# Altium project Pi_project.PrjPcb
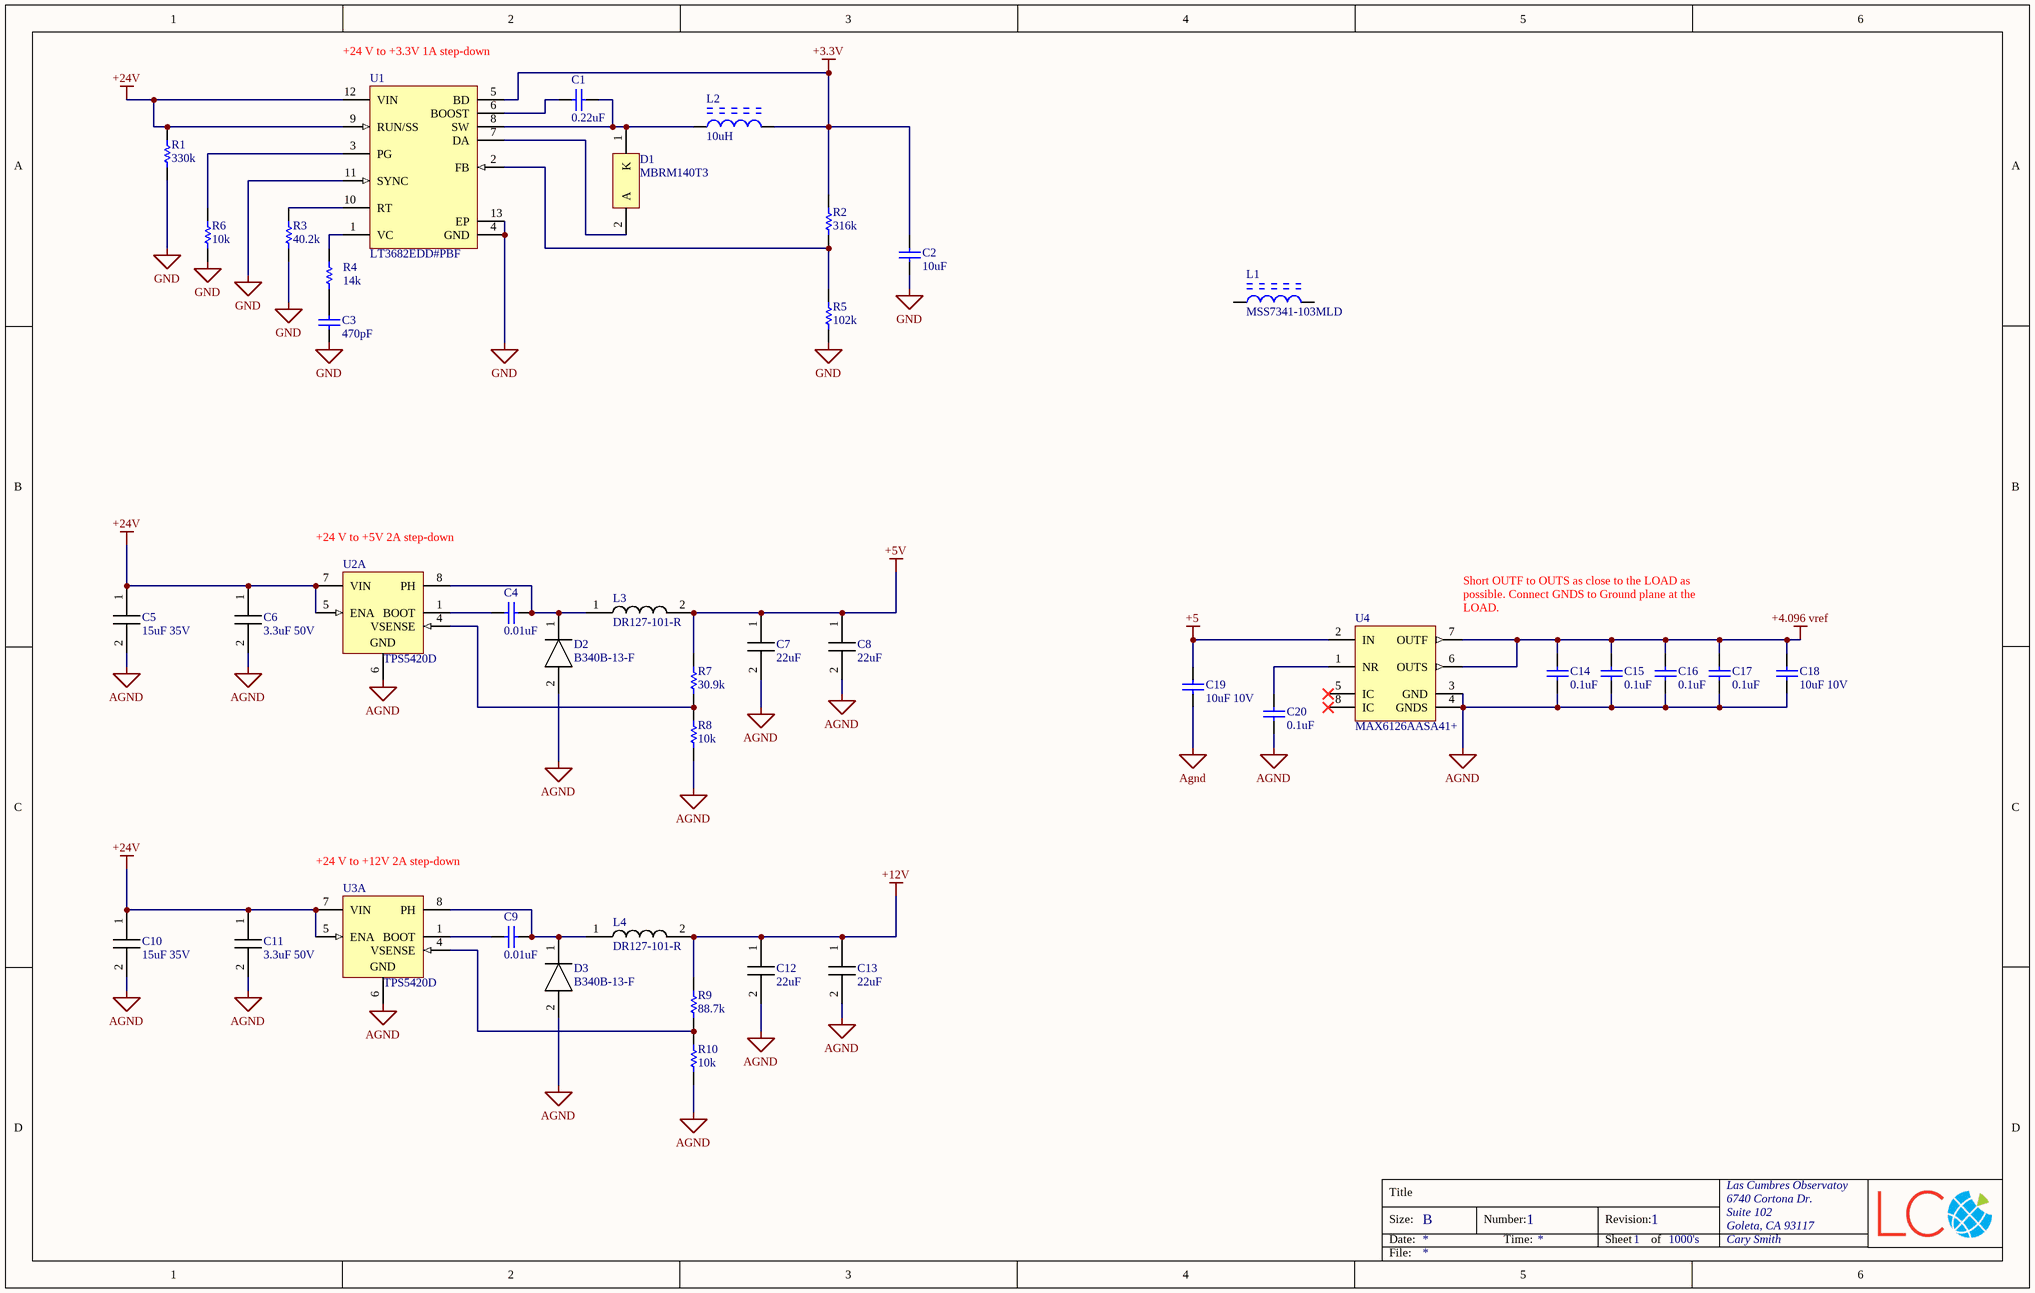
[diagram p0: Pi_Power.SchDoc]
9 sheets, 129 parts. Net scope: global (net labels, ports and power ports of the same name join across sheets).
Sheets:
  Pi_Power.SchDoc
  Pi_FPGA.SchDoc
  Pi_USB_2_UART.SchDoc
  Pi_HDMI.SchDoc
  Pi_ADC.SchDoc
  Pi_SD_CARD.SchDoc
  Pi_DISP.SchDoc
  Pi_Ethernet_USB.SchDoc
  Pi_BISS_422_485.SchDoc

## Sheet Pi_Power.SchDoc: =DocumentName
size B; DrawnBy: Cary Smith; Organization: Las Cumbres Observatoy; Address1: 6740 Cortona Dr.; Address2: Suite 102; Address3: Goleta, CA 93117; DocumentNumber: 1; Revision: 1; SheetNumber: 1; SheetTotal: 1000's

### Parts
C1  0.22uF  [CAPC1608X90X35NL15T15]
C2  10uF  [CAPC2013X145X50NL20T25]
C3  470pF  [CAPC1005X55X25ML05T10]
C4  0.01uF  [CAPC1608X90X35LL15T15]
C5  15uF 35V  [CAPPM7343X310N]
C6  3.3uF 50V  [CAPC3225X230N]
C7  22uF  [CAPC3216X180N]
C8  22uF  [CAPC3216X180N]
C9  0.01uF  [CAPC1608X90X35LL15T15]
C10  15uF 35V  [CAPPM7343X310N]
C11  3.3uF 50V  [CAPC3225X230N]
C12  22uF  [CAPC3216X180N]
C13  22uF  [CAPC3216X180N]
C14  0.1uF  [CAPC1005X55X25ML05T10]
C15  0.1uF  [CAPC1005X55X25ML05T10]
C16  0.1uF  [CAPC1005X55X25ML05T10]
C17  0.1uF  [CAPC1005X55X25ML05T10]
C18  10uF 10V  [CAPC1609X100X15LL20]
C19  10uF 10V  [CAPC1609X100X15LL20]
C20  0.1uF  [CAPC1005X55X25ML05T10]
D1  MBRM140T3  [ONSC-POWERMITE-2-457-04_D_V]
D2  B340B-13-F  [DIOM5336X250N]
D3  B340B-13-F  [DIOM5336X250N]
L1  MSS7341-103MLD  [COIL-MSS7341_V]
L2  10uH  [COIL-MSS7341_V]
L3  DR127-101-R  [INDM125125X800N]
L4  DR127-101-R  [INDM125125X800N]
R1  330k  [RESC1005X40X25ML05T05]
R2  316k  [RESC1005X40X25LL05T05]
R3  40.2k  [RESC1005X40X25NL05T05]
R4  14k  [RESC1005X40X25LL05T05]
R5  102k  [RESC1005X40X25ML05T05]
R6  10k  [RESC1005X40X25NL05T05]
R7  30.9k  [RESC1005X40X25NL05T05]
R8  10k  [RESC1005X40X25NL05T05]
R9  88.7k  [RESC1005X40X25NL05T05]
R10  10k  [RESC1005X40X25NL05T05]
U1  LT3682EDD#PBF  [LT-DD-12_V]
U2  TPS5420D  [D0008A_L]  (part A of 2)
U3  TPS5420D  [D0008A_L]  (part A of 2)
U4  MAX6126AASA41+  [MAXM-S8+4_M]

### Nets
+3.3V: C2.2 L2.2 R2.2 U1.5(BD)
+4.096 vref: C14.2 C15.2 C16.2 C17.2 C18.2 U4.6(OUTS) U4.7(OUTF)
+5: C19.2 U4.2(IN)
+5V: C7.1 C8.1 L3.2 R7.2
+12V: C12.1 C13.1 L4.2 R9.2
+24V: C5.1(+) C6.1 C10.1(+) C11.1 R1.2 U1.9(RUN/SS) U1.12(VIN) U2.5(ENA) U2.7(VIN) U3.5(ENA) U3.7(VIN)
AGND: C5.2(-) C6.2 C7.2 C8.2 C10.2(-) C11.2 C12.2 C13.2 C14.1 C15.1 C16.1 C17.1 C18.1 C19.1 C20.1 D2.2(A) D3.2(A) R8.1 R10.1 U2.6(GND) U3.6(GND) U4.3(GND) U4.4(GNDS)
GND: C2.1 C3.1 R1.1 R3.1 R5.1 R6.1 U1.4(GND) U1.11(SYNC) U1.13(EP)
NetC1_1: C1.1 D1.1(K) L2.1 U1.8(SW)
NetC1_2: C1.2 U1.6(BOOST)
NetC3_2: C3.2 R4.1
NetC4_1: C4.1 U2.1(BOOT)
NetC4_2: C4.2 D2.1(K) L3.1 U2.8(PH)
NetC9_1: C9.1 U3.1(BOOT)
NetC9_2: C9.2 D3.1(K) L4.1 U3.8(PH)
NetC20_2: C20.2 U4.1(NR)
NetD1_2: D1.2(A) U1.7(DA)
NetR2_1: R2.1 R5.2 U1.2(FB)
NetR3_2: R3.2 U1.10(RT)
NetR4_2: R4.2 U1.1(VC)
NetR6_2: R6.2 U1.3(PG)
NetR7_1: R7.1 R8.2 U2.4(VSENSE)
NetR9_1: R9.1 R10.2 U3.4(VSENSE)

Not connected (* = marked no-connect by the designer): L1 1 2; U4 5(IC)* 8(IC)*

### Notes on the sheet
- (near U1) +24 V to +3.3V 1A step-down
- (near U2) +24 V to +5V 2A step-down
- Short OUTF to OUTS as close to the LOAD as possible. Connect GNDS to Ground plane at the LOAD.
- (near U3) +24 V to +12V 2A step-down
- Title
- Size:
- Date:
- B
- Number:
- Time:
- Revision:
- Sheet
- of
- File:

### Library data of the parts
C1 = CMP-2006-04195-1: 06033D224KAT2A; Manufacturer: AVX Interconnect / Elco; Part Number: 06033D224KAT2A
C2 = CMP-2007-01019-1: C0805C106M8PACTU; Manufacturer: Kemet; Part Number: C0805C106M8PACTU
C3 = CMP-2008-04369-1: GRM1555C1H471JA01D; Manufacturer: Murata; Part Number: GRM1555C1H471JA01D
C4 C9 = CMP-2006-04374-1: 06035C-103KAT2A; Manufacturer: AVX Interconnect / Elco; Part Number: 06035C-103KAT2A
C5 C10 = 293D156X9035D2TE3: Capacitor 293D156X9035D2TE3; Manufacturer_Name: Vishay; Allied_Number: 70398878; Datasheet Link: http://www.vishay.com/docs/40002/293d.pdf; Height: 3.1mm; Manufacturer_Part_Number: 293D156X9035D2TE3; Mouser Part Number: 74-293D156X9035D2TE3; Mouser Price/Stock: https://www.mouser.com/Search/Refine.aspx?Keyword=74-293D156X9035D2TE3; RS Part Number: 6843960; RS Price/Stock: http://uk.rs-online.com/web/p/tantalum-capacitors/6843960/?source=DS; Allied Price/Stock: https://www.alliedelec.com/vishay-dale-293d156x9035d2te3/70398878/
C6 C11 = C3225X7R1H335M250AB: Capacitor C3225X7R1H335M250AB; Manufacturer_Name: TDK; Datasheet Link: https://product.tdk.com/info/en/catalog/datasheets/mlcc_commercial_midvoltage_en.pdf; Height: 2.3mm; Manufacturer_Part_Number: C3225X7R1H335M250AB; RS Part Number: 9163037P; RS Price/Stock: http://uk.rs-online.com/web/p/products/9163037P
C7 C8 C12 C13 = C3216X6S1C226M160AC: Capacitor C3216X6S1C226M160AC; Manufacturer_Name: TDK; Datasheet Link: https://product.tdk.com/info/en/catalog/datasheets/mlcc_commercial_midvoltage_en.pdf; Height: 1.8mm; Manufacturer_Part_Number: C3216X6S1C226M160AC
C14-C17 C20 = CMP-2008-02013-1: VJ0402G104KXQCW1BC; Manufacturer: Vitramon; Part Number: VJ0402G104KXQCW1BC
C18 C19 = CMP-2006-00193-1: TACL106M010XTA; Manufacturer: AVX Interconnect / Elco; Part Number: TACL106M010XTA
D1 = CMP-1055-00287-1: Schottky Power Rectifier, 2-Pin Powermite, Tape and Reel; Manufacturer: On Semiconductor; Configuration: Single; IFSM Max (A): 50; ComponentLink3Description: Package Specification; Packing: Tape and Reel; RoHS: FALSE; ComponentLink1Description: Manufacturer URL; ComponentLink2URL: http://www.onsemi.cn/pub/Collateral/MBRM140-D.PDF; DatasheetVersion: Rev. 4; PartNumber: MBRM140T3; ComponentLink1URL: http://www.onsemi.com/; ComponentLink3URL: http://www.onsemi.com/pub_link/Collateral/457-04.PDF; PackageVersion: Rev. F, 05/2013; PackageDescription: 2-Pin POWERMITE, Body 1.965 x 1.9 mm; Mounting Technology: Surface Mount; ComponentLink2Description: Datasheet; PackageReference: POWERMITE-2-457-04
D2 D3 = B340B-13-F: Diode; Manufacturer_Name: Diodes Inc.; Datasheet Link: https://componentsearchengine.com/Datasheets/2/B340B-13-F.pdf; Height: 2.5mm; Manufacturer_Part_Number: B340B-13-F; Mouser Part Number: 621-B340B-F; Mouser Price/Stock: https://www.mouser.com/Search/Refine.aspx?Keyword=621-B340B-F; RS Part Number: 9228119; RS Price/Stock: http://uk.rs-online.com/web/p/products/9228119
L1 = CMP-2000-06766-1: Shielded Power Inductor, 10 uH, +/- 20%, 3.8 A, 2-Pin SMD, RoHS, Tape and Reel; Manufacturer: Coilcraft; Maximum DC Current: 3.8A; Test Frequency: 100kHz; Self Resonant Frequency: 32MHz; Maximum DC Resistance: 38mOhms; Core Material: Ferrite; Inductance: 10uH; Manufacturer URL: http://www.coilcraft.com/; Length: 7.3mm; Series: MSS7341; Product Category: FixedInductors; Product: PowerInductors; Datasheet URL: http://www.coilcraft.com/pdfs/MSS7341.pdf; Termination Style: SMD/SMT; Tolerance: 20%; RoHS: True; Width: 7.3mm; Package Reference: MSS7341; Datasheet Version: 12/2015; Operating Temperature Range: -40Cto+85C; Height: 4.1mm; Mounting Style: SMD/SMT; Mounting Technology: SurfaceMount; Shielding: Shielded; Brand: Coilcraft; Package Description: 2-Pin Surface Mounted Device , Body 6.6 x 6.6 mm; Packaging: Reel
L2 = CMP-2000-06766-1: Shielded Power Inductor, 10 uH, +/- 20%, 3.8 A, 2-Pin SMD, RoHS, Tape and Reel MSS7341-103MLD; Manufacturer: Coilcraft; Maximum DC Current: 3.8A; Test Frequency: 100kHz; Self Resonant Frequency: 32MHz; Maximum DC Resistance: 38mOhms; Core Material: Ferrite; Manufacturer URL: http://www.coilcraft.com/; Length: 7.3mm; Series: MSS7341; Product Category: FixedInductors; Product: PowerInductors; Datasheet URL: http://www.coilcraft.com/pdfs/MSS7341.pdf; Termination Style: SMD/SMT; Tolerance: 20%; RoHS: True; Width: 7.3mm; Package Reference: MSS7341; Datasheet Version: 12/2015; Operating Temperature Range: -40Cto+85C; Height: 4.1mm; Mounting Style: SMD/SMT; Mounting Technology: SurfaceMount; Shielding: Shielded; Brand: Coilcraft; Package Description: 2-Pin Surface Mounted Device , Body 6.6 x 6.6 mm; Packaging: Reel; Inductance: 10uH
L3 L4 = DR127-101-R: Inductor; Manufacturer_Name: COILTRONICS; Allied_Number: 70037928; Manufacturer_Part_Number: DR127-101-R; Mouser Part Number: 704-DR127-101-R; Mouser Price/Stock: http://www.mouser.com/Search/ProductDetail.aspx?qs=yzwxPInThYS5S9GNGzgpHA%3d%3d; RS Part Number: 704-DR127-101-R; RS Price/Stock: http://www.mouser.com/Search/ProductDetail.aspx?qs=yzwxPInThYS5S9GNGzgpHA%3d%3d; Allied Price/Stock: https://www.alliedelec.com/coiltronics-dr127-101-r/70037928/
R1 = CMP-2002-08524-1: CRCW0402330RJNED; Manufacturer: Vishay Dale; Part Number: CRCW0402330RJNED
R2 = CMP-2002-08513-1: CRCW0402316KFKED; Manufacturer: Vishay Dale; Part Number: CRCW0402316KFKED
R3 = CMP-2002-08617-1: CRCW040240K2FKED; Manufacturer: Vishay Dale; Part Number: CRCW040240K2FKED
R4 = CMP-2002-08207-1: CRCW040214K0FKED; Manufacturer: Vishay Dale; Part Number: CRCW040214K0FKED
R5 = CMP-2002-08130-1: CRCW0402102KFKED; Manufacturer: Vishay Dale; Part Number: CRCW0402102KFKED
R6 R8 R10 = CMP-2002-08135-1: CRCW040210K0FKED; Manufacturer: Vishay Dale; Part Number: CRCW040210K0FKED
R7 = CMP-2002-00859-1: ERJ-2RKF30R9X; Manufacturer: Panasonic; Part Number: ERJ-2RKF30R9X
R9 = CMP-2002-00251-1: CRCW040288K7FKED; Manufacturer: Vishay Dale; Part Number: CRCW040288K7FKED
U1 = CMP-0491-00244-1: 1 A Micropower Step-Down Switching Regulator, 12-pin SON (DD-12), -40 to 125 degC, Pb-Free; Manufacturer: Linear Technology; Number of Outputs: 1; Over Voltage Protection(V): 60; Frequency Adjust Range: 250kHz - 2.2MHz; RoHS: TRUE; PackageDescription: 12-Pin Plastic DFN, Body 3 x 3 mm, Pitch 0.45 mm; PackageReference: DD-12; PartNumber: LT3682EDD#PBF; ComponentLink1URL: http://www.linear.com/; ComponentLink3URL: http://cds.linear.com/docs/en/packaging/DFN_12_05-08-1725.pdf; Mounting Technology: Surface Mount; ComponentLink1Description: Manufacturer URL; ComponentLink3Description: Package Specification; PackageVersion: Rev. A, 06/2010; ComponentLink2Description: Datasheet; ComponentLink2URL: http://cds.linear.com/docs/en/datasheet/3682f.pdf
U2 U3 = CMP-0323-00173-3: Buck Step Down Regulator with 5.5 to 36 V Input and 1.23 to 31 V Output, -40 to 125 degC, 8-Pin SOIC (D), Green (RoHS & no Sb/Br); Manufacturer: Texas Instruments; Vin(Max)(V): 36; Duty Cycle(Max)(%): 87; Vout(Max)(V): 31; Vout(Min)(V): 1.23; Switch Current Limit(Typ)(A): 3; Vin(Min)(V): 5.5; Regulated Outputs(#): 1; Rating: Catalog; Iout(Max)(A): 2; SubFamily: Step-Down Regulator; Code_JEDEC: MS-012AA; Topology: Buck; PackageDescription: 8-Pin Plastic Small Outline Integrated Circuit, 4.9 x 3.9 mm, Pitch 1.27 mm Pitch; PackageVersion: revM, Jun-2011; ComponentLink2Description: Package Specification; ComponentLink1URL: http://www.ti.com/general/docs/lit/getliterature.tsp?genericPartNumber=TPS5420&fileType=pdf; Mounting Technology: Surface Mount; ComponentLink3Description: URL Link1; PackageReference: D0008A; ComponentLink1Description: Datasheet; ComponentLink3URL: Samples URL:http://www.ti.com/product/tps5420#samples; Eco-Plan: Green (RoHS & no Sb/Br); ComponentLink2URL: http://www.ti.com/litv/pdf/msoi002j; DatasheetVersion: SLVS642C; Iq(Typ)(mA): 3; PartNumber: TPS5420D
U4 = CMP-0977-00016-1: Ultra-High-Precision, Ultra-Low-Noise, Series Voltage Reference, 4.096 V, -40 to 125 degC, 8-Pin SOIC (S8+4), RoHS, Tube; Manufacturer: Maxim; Output Voltage Accuracy: 0.02% Max.; Line Regulation: 60 uV/V Max.; VOUT: 4.096 V; Dropout Voltage@10 mA: 0.1 V Typ.; VIN: 4.3 to 12.6 V; Operating Temperature: -40 to 125 degC; ComponentLink3URL: http://pdfserv.maximintegrated.com/package_dwgs/21-0041.PDF; PartNumber: MAX6126AASA41+; RoHS: TRUE; ComponentLink3Description: Package Specification; ComponentLink1URL: http://www.maximintegrated.com/; Mounting Technology: Surface Mount; Packing: Tube; DatasheetVersion: Rev. 6; ComponentLink1Description: Manufacturer URL; ComponentLink2URL: http://datasheets.maximintegrated.com/en/ds/MAX6126.pdf; PackageDescription: 8-Pin Small Outline Integrated Circuit Package, Body 4.9 x 3.9 mm, Pitch 1.27 mm; ComponentLink2Description: Datasheet; PackageVersion: Rev. E

## Sheet Pi_FPGA.SchDoc: =DocumentName
size B; DrawnBy: Cary Smith; Organization: Las Cumbres Observatoy; Address1: 6740 Cortona Dr.; Address2: Suite 102; Address3: Goleta, CA 93117; DocumentNumber: 1; Revision: 1; SheetNumber: 1; SheetTotal: 1000's
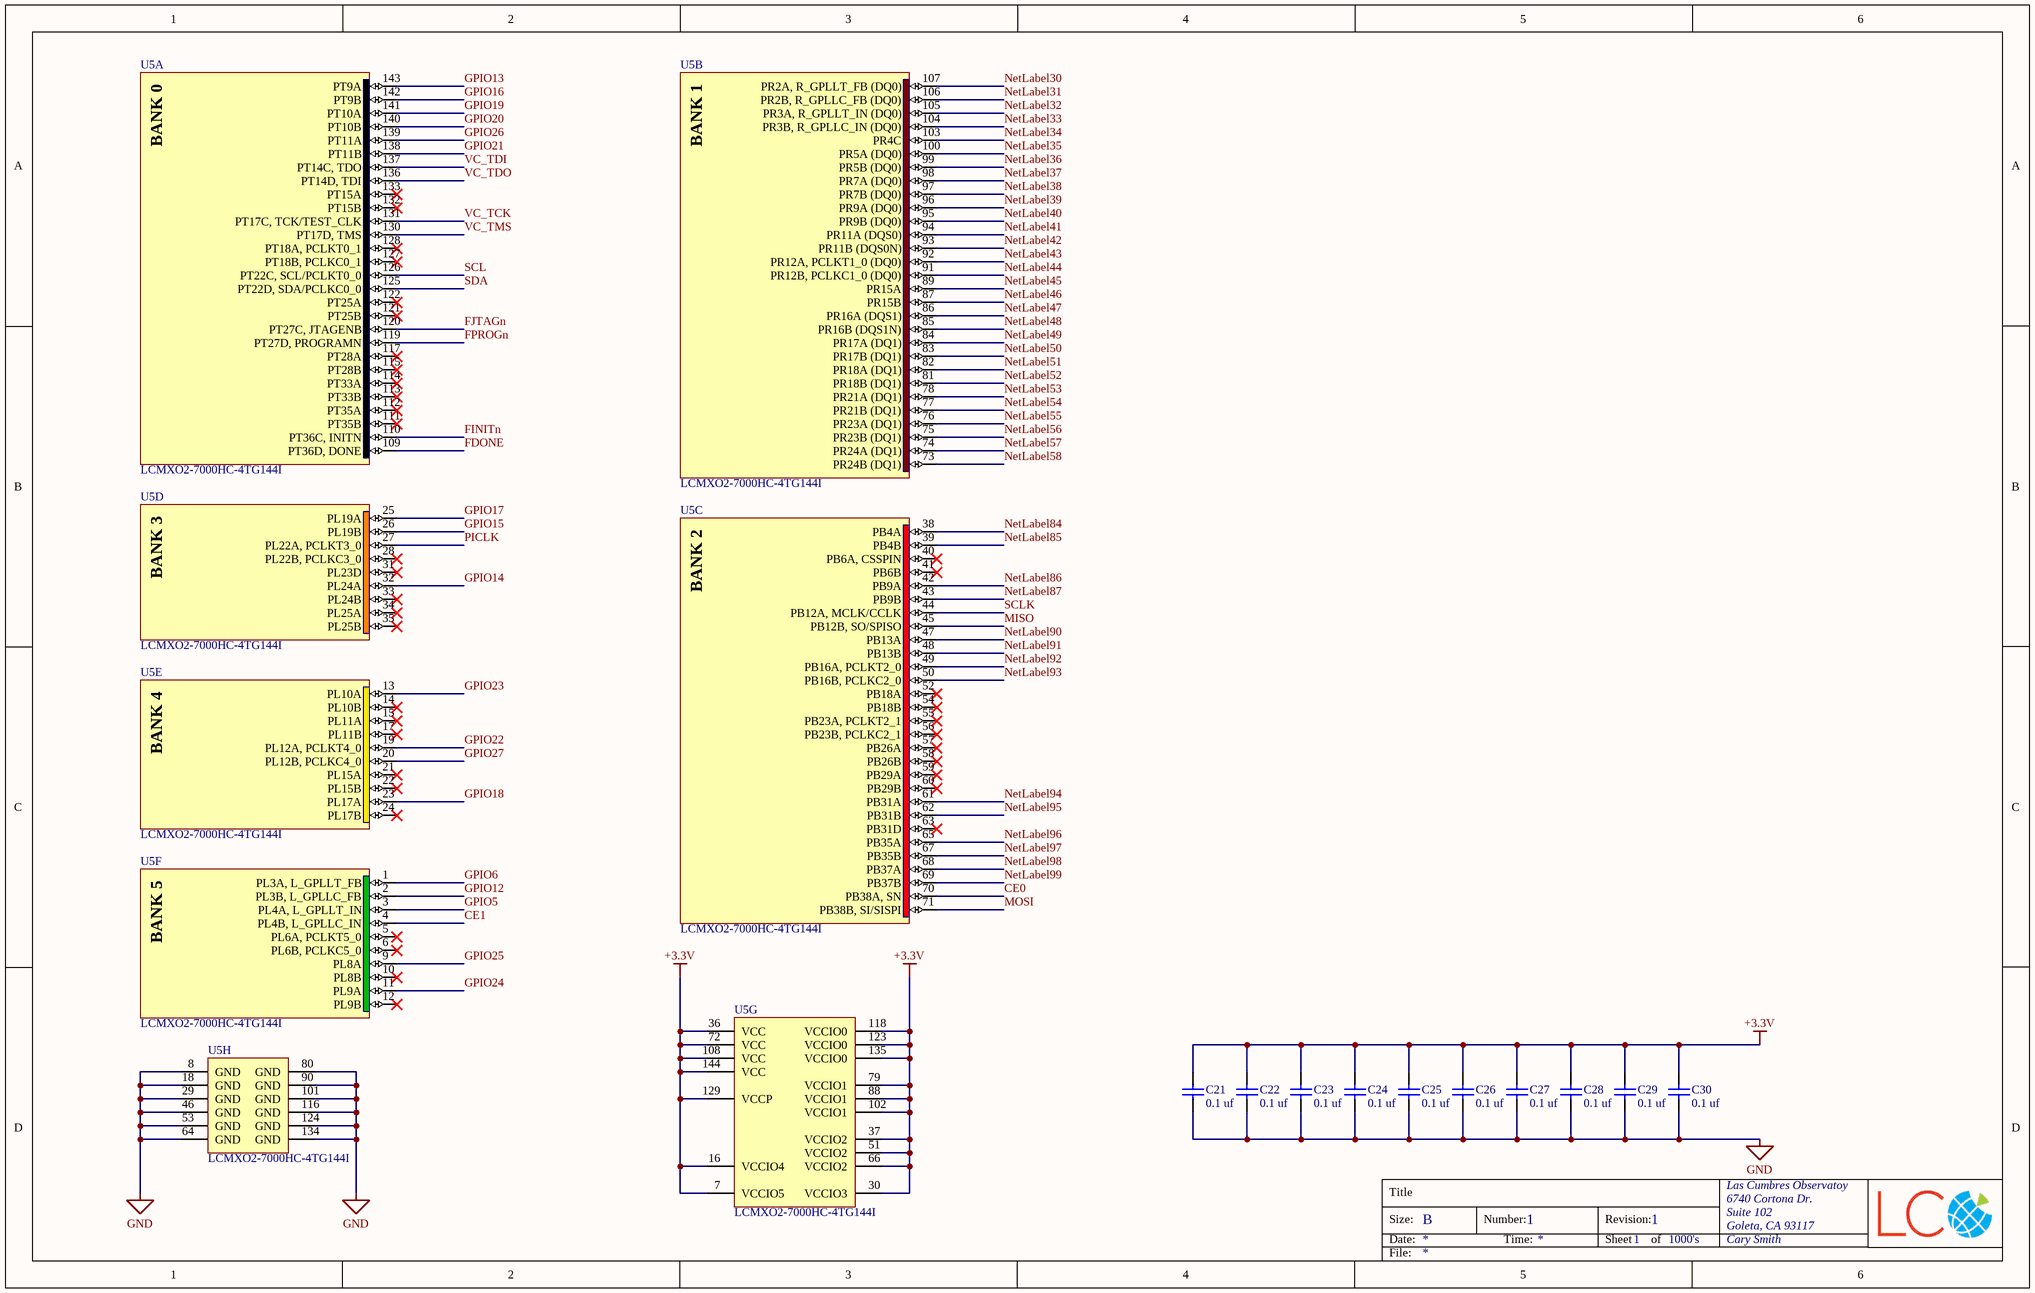
[diagram p1: Pi_FPGA.SchDoc]

### Parts
C21  0.1 uf  [CAPC1608X92X38LL15T08]
C22  0.1 uf  [CAPC1608X92X38LL15T08]
C23  0.1 uf  [CAPC1608X92X38LL15T08]
C24  0.1 uf  [CAPC1608X92X38LL15T08]
C25  0.1 uf  [CAPC1608X92X38LL15T08]
C26  0.1 uf  [CAPC1608X92X38LL15T08]
C27  0.1 uf  [CAPC1608X92X38LL15T08]
C28  0.1 uf  [CAPC1608X92X38LL15T08]
C29  0.1 uf  [CAPC1608X92X38LL15T08]
C30  0.1 uf  [CAPC1608X92X38LL15T08]
U5  LCMXO2-7000HC-4TG144I  [TQFP144_N]  (parts A,B,C,D,E,F,G,H of 8)

### Nets
+3.3V: C21.2 C22.2 C23.2 C24.2 C25.2 C26.2 C27.2 C28.2 C29.2 C30.2 U5.7(VCCIO5) U5.16(VCCIO4) U5.30(VCCIO3) U5.36(VCC) U5.37(VCCIO2) U5.51(VCCIO2) U5.66(VCCIO2) U5.72(VCC) U5.79(VCCIO1) U5.88(VCCIO1) U5.102(VCCIO1) U5.108(VCC) U5.118(VCCIO0) U5.123(VCCIO0) U5.129(VCCP) U5.135(VCCIO0) U5.144(VCC)
GND: C21.1 C22.1 C23.1 C24.1 C25.1 C26.1 C27.1 C28.1 C29.1 C30.1 U5.8(GND) U5.18(GND) U5.29(GND) U5.46(GND) U5.53(GND) U5.64(GND) U5.80(GND) U5.90(GND) U5.101(GND) U5.116(GND) U5.124(GND) U5.134(GND)
CE0: U5.70(PB38A,_SN)
CE1: U5.4(PL4B,_L_GPLLC_IN)
FDONE: U5.109(PT36D,_DONE)
FINITn: U5.110(PT36C,_INITN)
FJTAGn: U5.120(PT27C,_JTAGENB)
FPROGn: U5.119(PT27D,_PROGRAMN)
GPIO5: U5.3(PL4A,_L_GPLLT_IN)
GPIO6: U5.1(PL3A,_L_GPLLT_FB)
GPIO12: U5.2(PL3B,_L_GPLLC_FB)
GPIO13: U5.143(PT9A)
GPIO14: U5.32(PL24A)
GPIO15: U5.26(PL19B)
GPIO16: U5.142(PT9B)
GPIO17: U5.25(PL19A)
GPIO18: U5.23(PL17A)
GPIO19: U5.141(PT10A)
GPIO20: U5.140(PT10B)
GPIO21: U5.138(PT11B)
GPIO22: U5.19(PL12A,_PCLKT4_0)
GPIO23: U5.13(PL10A)
GPIO24: U5.11(PL9A)
GPIO25: U5.9(PL8A)
GPIO26: U5.139(PT11A)
GPIO27: U5.20(PL12B,_PCLKC4_0)
MISO: U5.45(PB12B,_SO/SPISO)
MOSI: U5.71(PB38B,_SI/SISPI)
NetLabel30: U5.107(PR2A,_R_GPLLT_FB_(DQ0))
NetLabel31: U5.106(PR2B,_R_GPLLC_FB_(DQ0))
NetLabel32: U5.105(PR3A,_R_GPLLT_IN_(DQ0))
NetLabel33: U5.104(PR3B,_R_GPLLC_IN_(DQ0))
NetLabel34: U5.103(PR4C)
NetLabel35: U5.100(PR5A_(DQ0))
NetLabel36: U5.99(PR5B_(DQ0))
NetLabel37: U5.98(PR7A_(DQ0))
NetLabel38: U5.97(PR7B_(DQ0))
NetLabel39: U5.96(PR9A_(DQ0))
NetLabel40: U5.95(PR9B_(DQ0))
NetLabel41: U5.94(PR11A_(DQS0))
NetLabel42: U5.93(PR11B_(DQS0N))
NetLabel43: U5.92(PR12A,_PCLKT1_0_(DQ0))
NetLabel44: U5.91(PR12B,_PCLKC1_0_(DQ0))
NetLabel45: U5.89(PR15A)
NetLabel46: U5.87(PR15B)
NetLabel47: U5.86(PR16A_(DQS1))
NetLabel48: U5.85(PR16B_(DQS1N))
NetLabel49: U5.84(PR17A_(DQ1))
NetLabel50: U5.83(PR17B_(DQ1))
NetLabel51: U5.82(PR18A_(DQ1))
NetLabel52: U5.81(PR18B_(DQ1))
NetLabel53: U5.78(PR21A_(DQ1))
NetLabel54: U5.77(PR21B_(DQ1))
NetLabel55: U5.76(PR23A_(DQ1))
NetLabel56: U5.75(PR23B_(DQ1))
NetLabel57: U5.74(PR24A_(DQ1))
NetLabel58: U5.73(PR24B_(DQ1))
NetLabel84: U5.38(PB4A)
NetLabel85: U5.39(PB4B)
NetLabel86: U5.42(PB9A)
NetLabel87: U5.43(PB9B)
NetLabel90: U5.47(PB13A)
NetLabel91: U5.48(PB13B)
NetLabel92: U5.49(PB16A,_PCLKT2_0)
NetLabel93: U5.50(PB16B,_PCLKC2_0)
NetLabel94: U5.61(PB31A)
NetLabel95: U5.62(PB31B)
NetLabel96: U5.65(PB35A)
NetLabel97: U5.67(PB35B)
NetLabel98: U5.68(PB37A)
NetLabel99: U5.69(PB37B)
PICLK: U5.27(PL22A,_PCLKT3_0)
SCL: U5.126(PT22C,_SCL/PCLKT0_0)
SCLK: U5.44(PB12A,_MCLK/CCLK)
SDA: U5.125(PT22D,_SDA/PCLKC0_0)
VC_TCK: U5.131(PT17C,_TCK/TEST_CLK)
VC_TDI: U5.137(PT14C,_TDO)
VC_TDO: U5.136(PT14D,_TDI)
VC_TMS: U5.130(PT17D,_TMS)

Not connected (* = marked no-connect by the designer): U5 5(PL6A,_PCLKT5_0)* 6(PL6B,_PCLKC5_0)* 10(PL8B)* 12(PL9B)* 14(PL10B)* 15(PL11A)* 17(PL11B)* 21(PL15A)* 22(PL15B)* 24(PL17B)* 28(PL22B,_PCLKC3_0)* 31(PL23D)* 33(PL24B)* 34(PL25A)* 35(PL25B)* 40(PB6A,_CSSPIN)* 41(PB6B)* 52(PB18A)* 54(PB18B)* 55(PB23A,_PCLKT2_1)* 56(PB23B,_PCLKC2_1)* 57(PB26A)* 58(PB26B)* 59(PB29A)* 60(PB29B)* 63(PB31D)* 111(PT35B)* 112(PT35A)* 113(PT33B)* 114(PT33A)* 115(PT28B)* 117(PT28A)* 121(PT25B)* 122(PT25A)* 127(PT18B,_PCLKC0_1)* 128(PT18A,_PCLKT0_1)* 132(PT15B)* 133(PT15A)*

### Notes on the sheet
- Title
- Size:
- Date:
- B
- Number:
- Time:
- Revision:
- Sheet
- of
- File:
- (in symbol CMP-0111-00300-1, part A) BANK 0
- (in symbol CMP-0111-00300-1, part B) BANK 1
- (in symbol CMP-0111-00300-1, part C) BANK 2
- (in symbol CMP-0111-00300-1, part D) BANK 3
- (in symbol CMP-0111-00300-1, part E) BANK 4
- (in symbol CMP-0111-00300-1, part F) BANK 5

### Library data of the parts
C21-C30 = CMP-2006-01974-1: VJ0603Y104KNXAO; Manufacturer: Vitramon; Part Number: VJ0603Y104KNXAO
U5 = CMP-0111-00300-1: MachXO2 High Performance CPLD with 6864 LUTs, Voltage Regulator, 2.5V/3.3V, 144-pin TQFP, Speed Grade-4, Industrial Grade, Halogen Free (RoHS); PackageVersion: ver02.6, Nov-2010; PackageDescription: 144-Pin Thin Quad Flat Pack (TQFP144); Code_JEDEC: MS-026-BFB; PackageReference: TQFP144; DatasheetVersion: ver01.0, Nov-2010

## Sheet Pi_USB_2_UART.SchDoc: =DocumentName
size B; DrawnBy: Cary Smith; Organization: Las Cumbres Observatoy; Address1: 6740 Cortona Dr.; Address2: Suite 102; Address3: Goleta, CA 93117; DocumentNumber: 1; Revision: 1; SheetNumber: 1; SheetTotal: 1000's
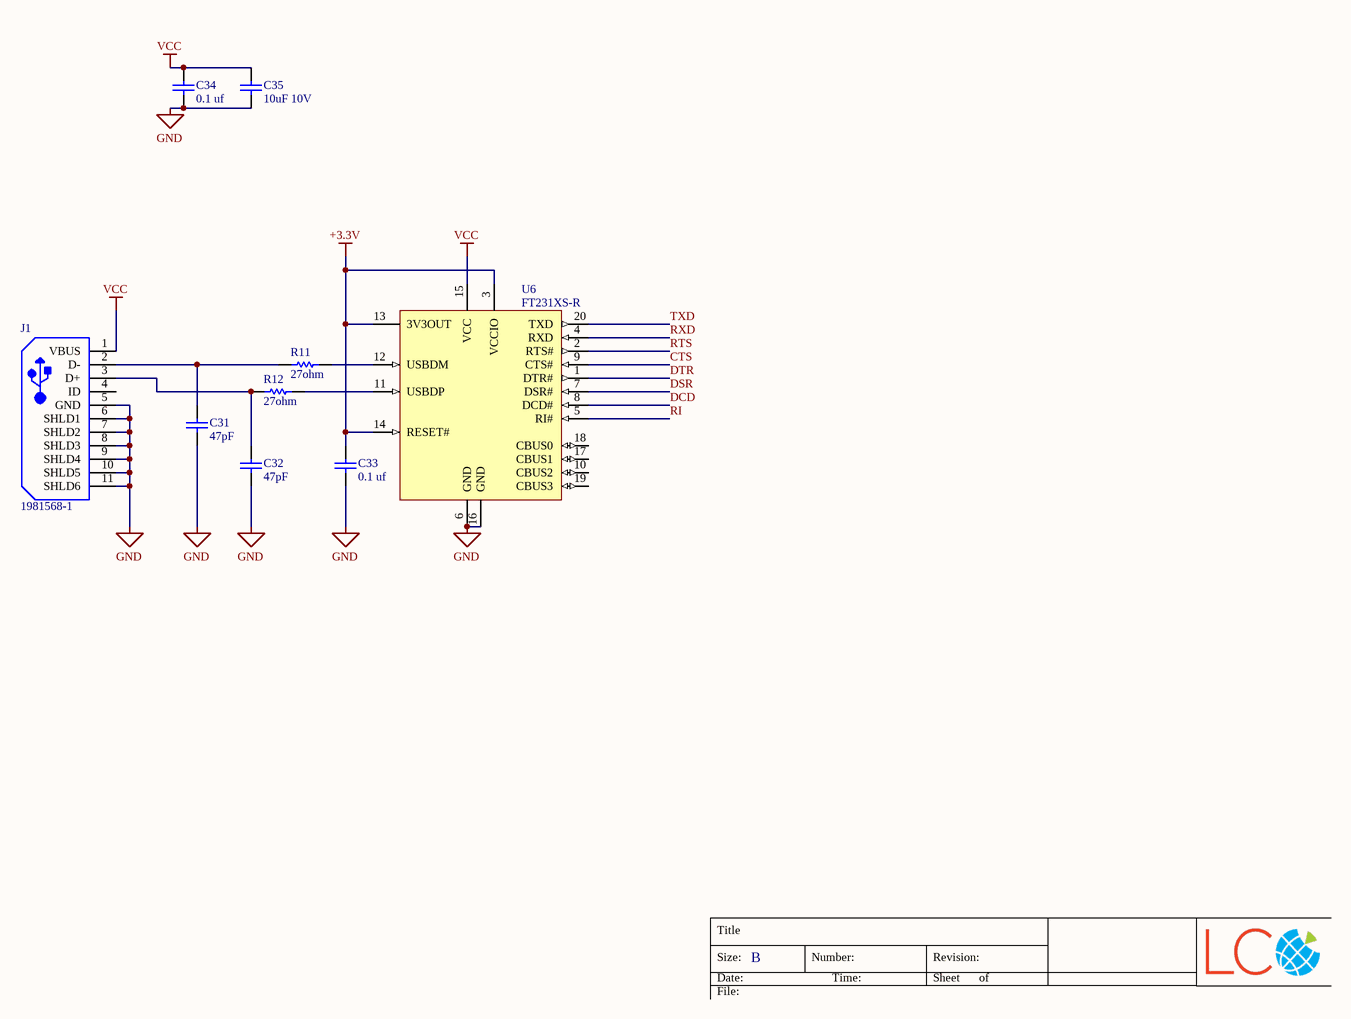
[diagram p2: Pi_USB_2_UART.SchDoc]

### Parts
C31  47pF  [CAPC1005X61X26NL10T16]
C32  47pF  [CAPC1005X61X26NL10T16]
C33  0.1 uf  [CAPC1608X92X38LL15T08]
C34  0.1 uf  [CAPC1608X92X38LL15T08]
C35  10uF 10V  [CAPC1609X100X15LL20]
J1  1981568-1  [TECO-1981568-5_V]
R11  27ohm  [RESC1005X40X25ML05T05]
R12  27ohm  [RESC1005X40X25ML05T05]
U6  FT231XS-R  [SSOP-20_L]

### Nets
+3.3V: C33.2 U6.3(VCCIO) U6.13(3V3OUT) U6.14(RESET#)
GND: C31.1 C32.1 C33.1 C34.1 C35.1 J1.5(GND) J1.6(SHLD1) J1.7(SHLD2) J1.8(SHLD3) J1.9(SHLD4) J1.10(SHLD5) J1.11(SHLD6) U6.6(GND) U6.16(GND)
VCC: C34.2 C35.2 J1.1(VBUS) U6.15(VCC)
CTS: U6.9(CTS#)
DCD: U6.8(DCD#)
DSR: U6.7(DSR#)
DTR: U6.1(DTR#)
RI: U6.5(RI#)
RTS: U6.2(RTS#)
RXD: U6.4(RXD)
TXD: U6.20(TXD)
NetC31_2: C31.2 J1.2(D-) R11.1
NetC32_2: C32.2 J1.3(D+) R12.1
NetR11_2: R11.2 U6.12(USBDM)
NetR12_2: R12.2 U6.11(USBDP)

Not connected (* = marked no-connect by the designer): J1 4(ID); U6 10(CBUS2) 17(CBUS1) 18(CBUS0) 19(CBUS3)

### Notes on the sheet
- Title
- Size:
- Date:
- B
- Number:
- Time:
- Revision:
- Sheet
- of
- File:

### Library data of the parts
C31 C32 = CMP-2008-02005-1: VJ0402D470JXAAJ; Manufacturer: Vitramon; Part Number: VJ0402D470JXAAJ
C33 C34 = CMP-2006-01974-1: VJ0603Y104KNXAO; Manufacturer: Vitramon; Part Number: VJ0603Y104KNXAO
C35 = CMP-2006-00193-1: as C18 on sheet Pi_Power; Part Number: TACL106M010XTA
J1 = CMP-2000-05408-1: Micro USB Receptacle Standard Type B Assy, 5-Pin SMD, RoHS, Tape and Reel; Manufacturer: TE Connectivity; Body Orientation: RightAngle; Number of Ports: 1Port; Number of Contacts: 5POS; Gender: RCP; Voltage Rating Max: 30VAC; Product Depth (mm): 5.6mm; Pitch (mm): 0.65mm; Current Rating (Max): 1/ContactA; Product Length (mm): 8mm; Product Height (mm): 3mm; Operating Temperature Max Deg. C: 85C; Datasheet URL: http://www.mouser.com/ds/2/418/NG_CD_1981568_E2-621296.pdf; Termination Method: Solder; Number of Terminals: 5; Operating Temp Range: -55Cto85C; Mounting Style: SurfaceMount; Manufacturer URL: http://www.te.com/; Contact Material: CopperAlloy; Packaging: TapeandReel; Datasheet Version: Rev. E2, 08/2015; Operating Temperature Min Deg. C: -55C; Housing Material: Thermoplastic; Type: MicroUSB; Contact Plating: GoldOverNickel
R11 R12 = CMP-2002-08427-1: CRCW0402270RFKED; Manufacturer: Vishay Dale; Part Number: CRCW0402270RFKED
U6 = CMP-0248-00024-2: USB to Full-Handshake UART Interface Chip, UHCI/OHCI/EHCI Compatible, USB 2.0 Compatible, -40 to +85 degC, 20-Pin SSOP, Pb-Free, Tape and Reel; Manufacturer: FTDI; PackageVersion: Feb-13; PackageReference: SSOP-20; ComponentLink1Description: Manufacturer URL; ComponentLink2Description: Datasheet; PackageDescription: 20-Pin Small Outline Package, 8.6 x 3.9 mm Body, 0.635 mm Pitch; ComponentLink3URL: www.ftdichip.com/Products/ICs/FT231X.html; PartNumber: FT231XS-R; DatasheetVersion: ver 1.2, Feb-2013; ComponentLink2URL: http://www.ftdichip.com/Support/Documents/DataSheets/ICs/DS_FT231X.pdf; Code_JEDEC: MO-137-AD; ComponentLink3Description: FT231X Product Page; RevisionNote: DatasheetVersion updated to 1.2 Feb-2013; ComponentLink1URL: http://www.ftdichip.com/

## Sheet Pi_HDMI.SchDoc: =DocumentName
size B; DrawnBy: Cary Smith; Organization: Las Cumbres Observatoy; Address1: 6740 Cortona Dr.; Address2: Suite 102; Address3: Goleta, CA 93117; DocumentNumber: 1; Revision: 1; SheetNumber: 1; SheetTotal: 1000's
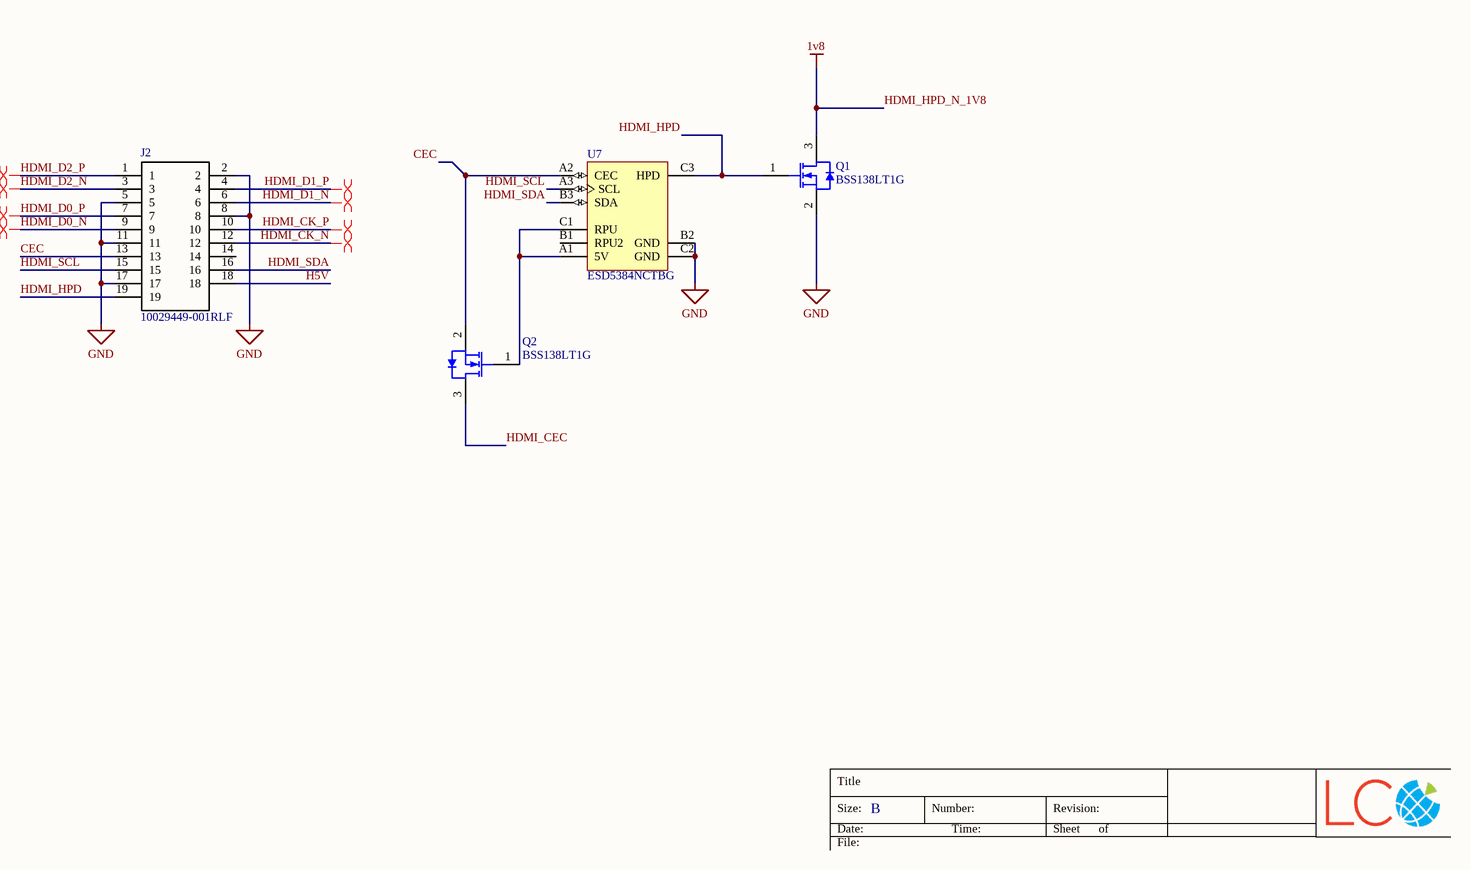
[diagram p3: Pi_HDMI.SchDoc]

### Parts
J2  10029449-001RLF  [10029449-001RLF_FCI]
Q1  BSS138LT1G  [ONSC-SOT-23-3-318-08_V]
Q2  BSS138LT1G  [ONSC-SOT-23-3-318-08_V]
U7  ESD5384NCTBG  [ONSC-WLCSP-9-567CX-01]

### Nets
GND: J2.2 J2.5 J2.8 J2.11 J2.17 Q1.2(S) U7.B2(GND) U7.C2(GND)
HDMI_HPD_N_1V8: Q1.3(D)  [also labelled 1v8]
CEC: J2.13 Q2.2(S) U7.A2(CEC)
H5V: J2.18
HDMI_CEC: Q2.3(D)
HDMI_CK_N: J2.12
HDMI_CK_P: J2.10
HDMI_D0_N: J2.9
HDMI_D0_P: J2.7
HDMI_D1_N: J2.6
HDMI_D1_P: J2.4
HDMI_D2_N: J2.3
HDMI_D2_P: J2.1
HDMI_HPD: J2.19 Q1.1(G) U7.C3(HPD)
HDMI_SCL: J2.15 U7.A3(SCL)
HDMI_SDA: J2.16 U7.B3(SDA)
NetQ2_1: Q2.1(G) U7.A1(5V) U7.C1(RPU)

Not connected (* = marked no-connect by the designer): J2 14; U7 B1(RPU2)

### Layout directives
differential pair: HDMI_CK_N, HDMI_CK_P, HDMI_D0_N, HDMI_D0_P, HDMI_D1_N, HDMI_D1_P, HDMI_D2_N, HDMI_D2_P

### Notes on the sheet
- Title
- Size:
- Date:
- B
- Number:
- Time:
- Revision:
- Sheet
- of
- File:

### Library data of the parts
J2 = 10029449-001RLF: Connector; Manufacturer_Name: FCI; Allied_Number: 70247646; Datasheet Link: https://componentsearchengine.com/Datasheets/2/10029449-001RLF.pdf; Manufacturer_Part_Number: 10029449-001RLF; Mouser Part Number: 649-10029449-001RLF; Mouser Price/Stock: https://www.mouser.com/Search/Refine.aspx?Keyword=649-10029449-001RLF; RS Part Number: 1621999; RS Price/Stock: http://uk.rs-online.com/web/p/products/1621999; Allied Price/Stock: https://www.alliedelec.com/amphenol-fci-10029449-001rlf/70247646/
Q1 Q2 = CMP-1058-00767-1: Power MOSFET, 200 mA, 50 V, N-Channel, 3-Pin SOT-23, Pb-Free, Tape and Reel; Manufacturer: On Semiconductor; PD Max (W): 0.225; Coss Typ (pF): 12; V(BR)DSS Min (V): 50; VGS Max (V): 20; Channel Polarity: N Channel; Configuration: Single; VGS(th) Max (V): 1.5; Ciss Typ (pF): 40; Crss Typ (pF): 3.5; ID Max (A): 0.2; ComponentLink3Description: Package Specification; PackageDescription: 3-Pin Small Outline Transistor, Body 2.92 x 1.3 mm, Pitch 0.95 mm; PackageReference: SOT-23-3-318-08; RoHS: Pb-Free; Mounting Technology: Surface Mount; ComponentLink1Description: Manufacturer URL; ComponentLink2URL: http://www.onsemi.com/pub_link/Collateral/BSS138LT1-D.PDF; ComponentLink2Description: Datasheet; Packing: Tape and Reel; PackageVersion: Rev. AP, 11/2009; PartNumber: BSS138LT1G; Package Type: SOT-23-3; ComponentLink1URL: http://www.onsemi.com/; DatasheetVersion: Rev. 8; ComponentLink3URL: http://www.onsemi.cn/pub_link/Collateral/318-08.PDF
U7 = CMP-1063-00280-1: 5-Line HDMI Control Line, ESD Protection, 9-Pin WLCSP, Pb-Free, Tape and Reel; Manufacturer: On Semiconductor; Direction: Unidirectional; V(BR) Min (V): 6; Number of Lines: 5; ComponentLink1URL: http://www.onsemi.com/; DatasheetVersion: Rev. 0; ComponentLink2URL: http://www.onsemi.cn/pub_link/Collateral/ESD5384-D.PDF; PackageDescription: 9-Ball Wafer Level Chip Scale Package, Body 1.14 x 1.14 mm, Pitch 0.4 mm; Packing: Tape and Reel; ComponentLink3URL: http://www.onsemi.cn/pub_link/Collateral/567CX.PDF; PackageVersion: Rev. O, 10/2010; PackageReference: WLCSP-9-567CX-01; ComponentLink3Description: Package Specification; RoHS: Pb-Free; PartNumber: ESD5384NCTBG; ComponentLink1Description: Manufacturer URL; Mounting Technology: Surface Mount; ComponentLink2Description: Datasheet

## Sheet Pi_ADC.SchDoc: =DocumentName
size B; DrawnBy: Cary Smith; Organization: Las Cumbres Observatoy; Address1: 6740 Cortona Dr.; Address2: Suite 102; Address3: Goleta, CA 93117; DocumentNumber: 1; Revision: 1; SheetNumber: 1; SheetTotal: 1000's
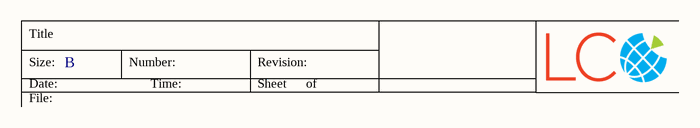
[diagram p4: Pi_ADC.SchDoc]

### Notes on the sheet
- Title
- Size:
- Date:
- B
- Number:
- Time:
- Revision:
- Sheet
- of
- File:

## Sheet Pi_SD_CARD.SchDoc: =DocumentName
size B; DrawnBy: Cary Smith; Organization: Las Cumbres Observatoy; Address1: 6740 Cortona Dr.; Address2: Suite 102; Address3: Goleta, CA 93117; DocumentNumber: 1; Revision: 1; SheetNumber: 1; SheetTotal: 1000's
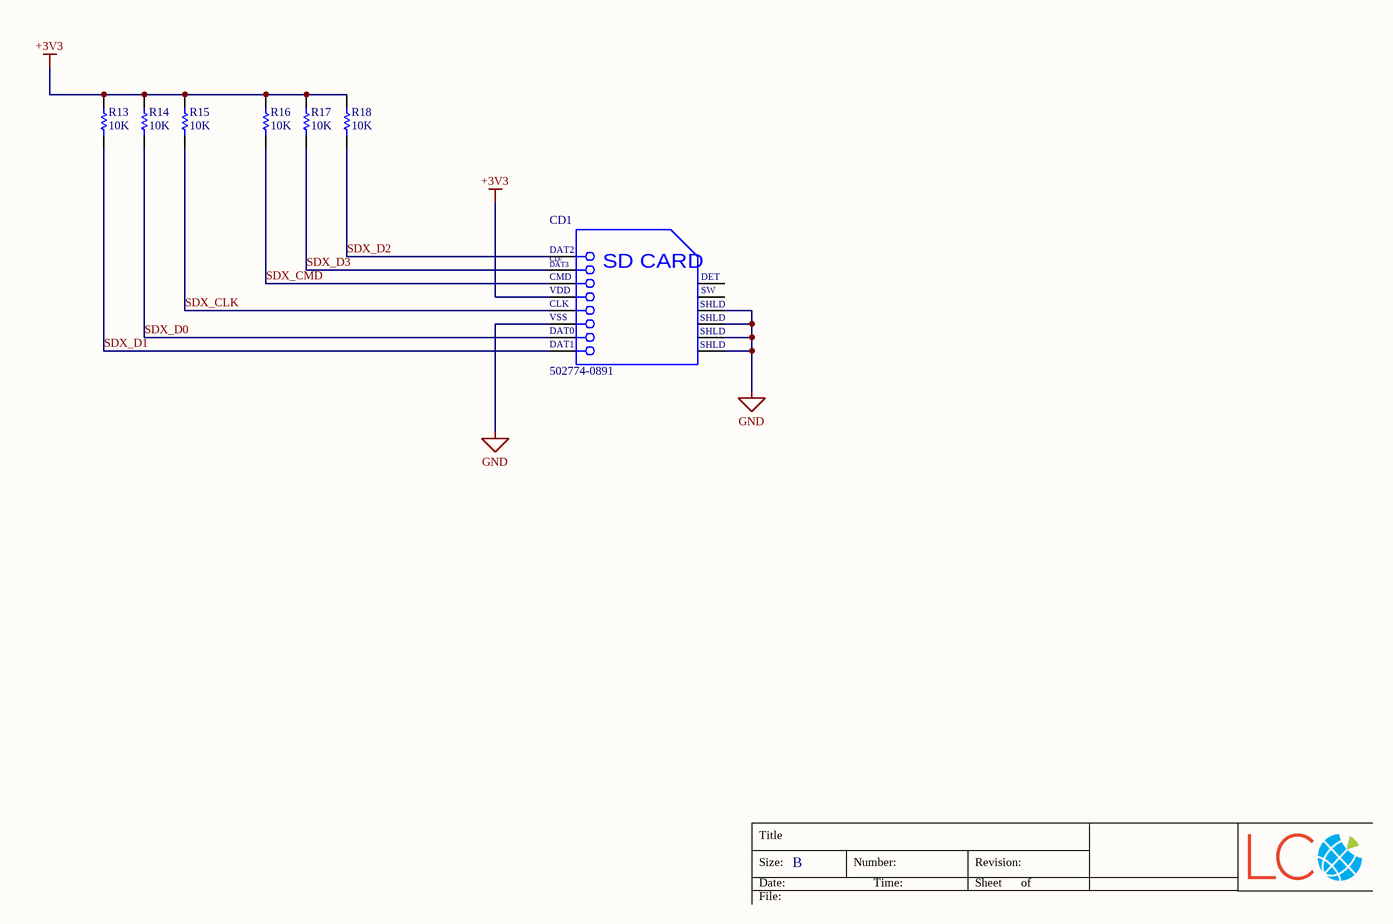
[diagram p5: Pi_SD_CARD.SchDoc]

### Parts
CD1  502774-0891  [MOLX-502774-0891_V]
R13  10K  [RESC1005X40X25NL05T05]
R14  10K  [RESC1005X40X25NL05T05]
R15  10K  [RESC1005X40X25NL05T05]
R16  10K  [RESC1005X40X25NL05T05]
R17  10K  [RESC1005X40X25NL05T05]
R18  10K  [RESC1005X40X25NL05T05]

### Nets
+3V3: CD1.4(VDD) R13.2 R14.2 R15.2 R16.2 R17.2 R18.2
GND: CD1.6(VSS) CD1.11(SHLD) CD1.12(SHLD) CD1.13(SHLD) CD1.14(SHLD)
SDX_CLK: CD1.5(CLK) R15.1
SDX_CMD: CD1.3(CMD) R16.1
SDX_D0: CD1.7(DAT0) R14.1
SDX_D1: CD1.8(DAT1) R13.1
SDX_D2: CD1.1(DAT2) R18.1
SDX_D3: CD1.2(CD/DAT3) R17.1

Not connected (* = marked no-connect by the designer): CD1 9(DETECT) 10(SWITCH)

### Notes on the sheet
- Title
- Size:
- Date:
- B
- Number:
- Time:
- Revision:
- Sheet
- of
- File:
- (in symbol CMP-2000-05248-1) CD/; DAT3; SD CARD; DET; SW

### Library data of the parts
CD1 = CMP-2000-05248-1: Micro SD Memory Card Connector, 0.5 A, 10 V (DC), -25 to 85 degC, 8-Pin SMT, RoHS, Tape and Reel; Manufacturer: Molex; 3D Model: 502774-0891.stp; Online Catalog: microSD™Series; Number of Positions: 10(8+2); Card Type: SecureDigital-microSD™; Insertion, Removal Method: PushIn,PushOut; Other Names: WM24066DKR; Connector Type: ConnectorandEjector; Features: Switch; Family: MemoryConnectors-PCCardSockets; Manufacturer URL: http://www.molex.com/; Mounting Type: SurfaceMount,RightAngle; Contact Finish Thickness: 20µin(0.51µm); Standard Package: 1; Series: 502774; Ejector Side: -; Datasheet Version: Rev. D, 04/2004; Category: Connectors,Interconnects; Contact Finish: Gold; Datasheet URL: https://datasheet.ciiva.com/1104/1499551-1104671.pdf; RoHS Information: 502774-0891CertofCompliance; Mounting Feature: Reverse-Bottom; Packaging: Digi-Reel; Catalog Drawings: 502774-0891
R13-R18 = CMP-2002-08135-1: as R6 on sheet Pi_Power; Part Number: CRCW040210K0FKED

## Sheet Pi_DISP.SchDoc: =DocumentName
size B; DrawnBy: Cary Smith; Organization: Las Cumbres Observatoy; Address1: 6740 Cortona Dr.; Address2: Suite 102; Address3: Goleta, CA 93117; DocumentNumber: 1; Revision: 1; SheetNumber: 1; SheetTotal: 1000's
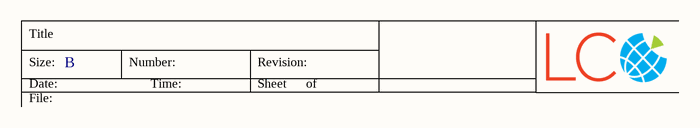
[diagram p6: Pi_DISP.SchDoc]

### Notes on the sheet
- Title
- Size:
- Date:
- B
- Number:
- Time:
- Revision:
- Sheet
- of
- File:

## Sheet Pi_Ethernet_USB.SchDoc: =DocumentName
size B; DrawnBy: Cary Smith; Organization: Las Cumbres Observatoy; Address1: 6740 Cortona Dr.; Address2: Suite 102; Address3: Goleta, CA 93117; DocumentNumber: 1; Revision: 1; SheetNumber: 1; SheetTotal: 1000's
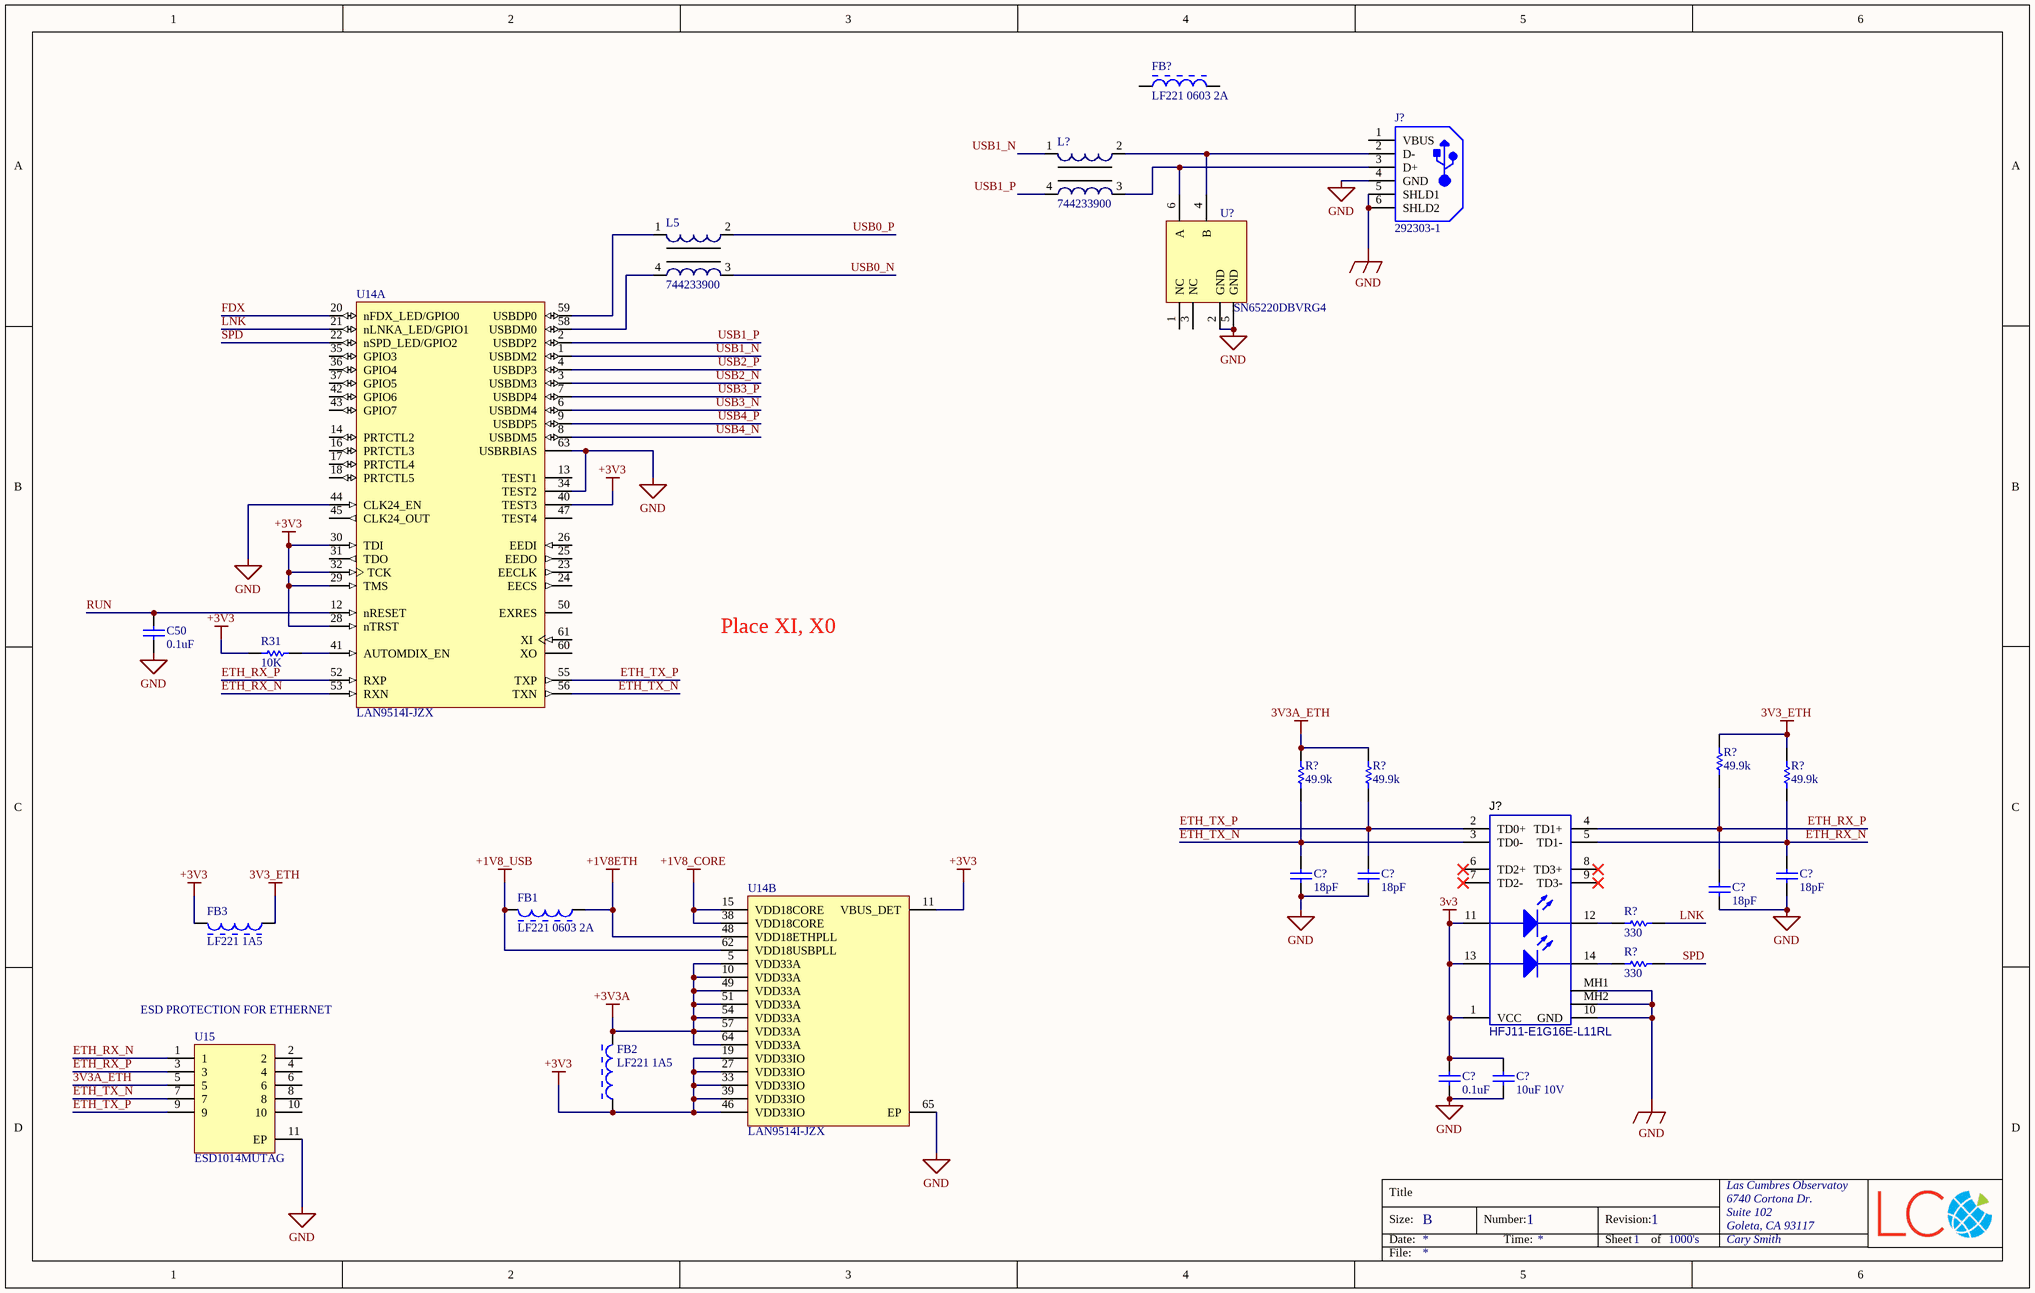
[diagram p7: Pi_Ethernet_USB.SchDoc]

### Parts
(Parts that share a designator on the sheet are numbered #1, #2 ... from top to bottom, then left to right.)
C50  0.1uF  [CAPC1005X55X25ML05T10]
C?#1  18pF  [CAPC1608X90X35NL15T15]
C?#2  18pF  [CAPC1608X90X35NL15T15]
C?#3  18pF  [CAPC1608X90X35NL15T15]
C?#4  18pF  [CAPC1608X90X35NL15T15]
C?#5  0.1uF  [CAPC1005X55X25ML05T10]
C?#6  10uF 10V  [CAPC1609X100X15LL20]
FB1  LF221 0603 2A  [MURA-BLM18-F-H1-CHIP-2_V]
FB2  LF221 1A5  [MURA-BLM15-CHIP-2_V]
FB3  LF221 1A5  [MURA-BLM15-CHIP-2_V]
FB?  LF221 0603 2A  [MURA-BLM18-F-H1-CHIP-2_V]
J?#1  292303-1  [TE-292303-1_V]
J?#2  HFJ11-E1G16E-L11RL  [HLE-HFJ11-E1G16E-L11RL_V]
L5  744233900  [WE-CNSW, 0805]
L?  744233900  [WE-CNSW, 0805]
R31  10K  [RESC1609X50X30ML10T20]
R?#1  49.9k  [RESC1609X50X30ML10T20]
R?#2  49.9k  [RESC1609X50X30ML10T20]
R?#3  49.9k  [RESC1609X50X30ML10T20]
R?#4  49.9k  [RESC1609X50X30ML10T20]
R?#5  330  [RESC1609X50X30NL10T20]
R?#6  330  [RESC1609X50X30NL10T20]
U14  LAN9514I-JZX  [MCHP-QFN-64-7300x7300TP_V]  (parts A,B of 2)
U15  ESD1014MUTAG  [ONSC-UDFN-10-517AN_V]
U?  SN65220DBVRG4  [DBV0006A_L]

### Nets
3v3: C?#5.2 C?#6.2 J?#2.1(VCC) J?#2.11 J?#2.13
3V3_ETH: FB3.1 R?#1.2 R?#4.2
3V3A_ETH: R?#2.2 R?#3.2 U15.5
+1V8_CORE: U14.15(VDD18CORE) U14.38(VDD18CORE)
+1V8_USB: FB1.2 U14.62(VDD18USBPLL)
+1V8ETH: FB1.1 U14.48(VDD18ETHPLL)
+3V3: FB2.1 FB3.2 R31.1 U14.11(VBUS_DET) U14.19(VDD33IO) U14.27(VDD33IO) U14.28(nTRST) U14.29(TMS) U14.30(TDI) U14.32(TCK) U14.33(VDD33IO) U14.39(VDD33IO) U14.40(TEST3) U14.46(VDD33IO)
+3V3A: FB2.2 U14.5(VDD33A) U14.10(VDD33A) U14.49(VDD33A) U14.51(VDD33A) U14.54(VDD33A) U14.57(VDD33A) U14.64(VDD33A)
GND: C50.2 C?#1.1 C?#2.1 C?#3.1 C?#4.1 C?#5.1 C?#6.1 J?#1.4(GND) J?#1.5(SHLD1) J?#1.6(SHLD2) J?#2.10(GND) J?#2.MH1 J?#2.MH2 U14.34(TEST2) U14.44(CLK24_EN) U14.63(USBRBIAS) U14.65(EP) U15.11(EP) U?.2(GND) U?.5(GND)
ETH_RX_N: C?#3.2 J?#2.5(TD1-) R?#4.1 U14.53(RXN) U15.1
ETH_RX_P: C?#4.2 J?#2.4(TD1+) R?#1.1 U14.52(RXP) U15.3
ETH_TX_N: C?#1.2 J?#2.3(TD0-) R?#2.1 U14.56(TXN) U15.7
ETH_TX_P: C?#2.2 J?#2.2(TD0+) R?#3.1 U14.55(TXP) U15.9
FDX: U14.20(nFDX_LED/GPIO0)
LNK: R?#5.2 U14.21(nLNKA_LED/GPIO1)
RUN: C50.1 U14.12(nRESET)
SPD: R?#6.2 U14.22(nSPD_LED/GPIO2)
USB0_N: L5.3
USB0_P: L5.2
USB1_N: L?.1 U14.1(USBDM2)
USB1_P: L?.4 U14.2(USBDP2)
USB2_N: U14.3(USBDM3)
USB2_P: U14.4(USBDP3)
USB3_N: U14.6(USBDM4)
USB3_P: U14.7(USBDP4)
USB4_N: U14.8(USBDM5)
USB4_P: U14.9(USBDP5)
NetJ?#1_2: J?#1.2(D-) L?.2 U?.4(B)
NetJ?#1_3: J?#1.3(D+) L?.3 U?.6(A)
NetJ?#2_12: J?#2.12 R?#5.1
NetJ?#2_14: J?#2.14 R?#6.1
NetL5_1: L5.1 U14.59(USBDP0)
NetL5_4: L5.4 U14.58(USBDM0)
NetR31_2: R31.2 U14.41(AUTOMDIX_EN)

Not connected (* = marked no-connect by the designer): FB? 1 2; J?#1 1(VBUS); J?#2 6(TD2+)* 7(TD2-)* 8(TD3+)* 9(TD3-)*; U14 13(TEST1) 14(PRTCTL2) 16(PRTCTL3) 17(PRTCTL4) 18(PRTCTL5) 23(EECLK) 24(EECS) 25(EEDO) 26(EEDI) 31(TDO) 35(GPIO3) 36(GPIO4) 37(GPIO5) 42(GPIO6) 43(GPIO7) 45(CLK24_OUT) 47(TEST4) 50(EXRES) 60(XO) 61(XI); U15 2 4 6 8 10; U? 1(NC) 3(NC)

### Notes on the sheet
- Place XI, X0
- (near U15) ESD PROTECTION FOR ETHERNET
- Title
- Size:
- Date:
- B
- Number:
- Time:
- Revision:
- Sheet
- of
- File:

### Library data of the parts
C50 C?#5 = CMP-2008-02013-1: as C14 on sheet Pi_Power; Part Number: VJ0402G104KXQCW1BC
C?#1-C?#4 = CMP-2006-04004-1: 06031A180JAT2A; Manufacturer: AVX Interconnect / Elco; Part Number: 06031A180JAT2A
C?#6 = CMP-2006-00193-1: as C18 on sheet Pi_Power; Part Number: TACL106M010XTA
FB1 FB? = CMP-0686-00359-2: Chip Ferrite Bead for GHz Band General Use (Low DC Resistance Type), 220 Ohm, 2000 mA, -55 to 125 degC, 1.6 x 0.8 x 0.95 mm SMD, Tape and Reel BLM18EG221SN1J; Manufacturer: Murata; Impedance (at 100 MHz): 220 Ohm +/- 25%; DC Resistance: 0.05 Ohm Max.; Rated Current: 2000 mA; ComponentLink3Description: Package Specification; ComponentLink1Description: Manufacturer URL; PackageDescription: 2-Pin Chip, Body 1.6 x 0.8 mm; ComponentLink2URL: http://www.murata.com/products/catalog/pdf/c31e.pdf; Mounting Technology: Surface Mount; ComponentLink3URL: http://www.murata.com/products/catalog/pdf/c31e.pdf; ComponentLink1URL: http://www.murata.com/; PackageReference: BLM18_H950-2; PartNumber: BLM18EG221SN1J; Packing: Tape and Reel; DatasheetVersion: 08/2013; Operating Temperature Range: -55 to 125 degC; ComponentLink2Description: Datasheet
FB2 FB3 = CMP-0686-00268-2: Chip Ferrite Bead for Power Lines, 220 Ohm, 1400 mA, -55 to 125 degC, 1 x 0.5 x 0.55 mm SMD, Bulk BLM15PX221SN1B; Manufacturer: Murata; DC Resistance: 0.10 Ohm Max.; Impedance (at 100 MHz): 220 Ohm +/- 25%; Rated Current: 1400 mA; DatasheetVersion: 08/2013; ComponentLink2URL: http://www.murata.com/products/catalog/pdf/c31e.pdf; Packing: Bulk; PartNumber: BLM15PX221SN1B; Mounting Technology: Surface Mount; ComponentLink1Description: Manufacturer URL; Operating Temperature Range: -55 to 125 degC; ComponentLink1URL: http://www.murata.com/; PackageReference: BLM15-2; PackageDescription: 2-Pin Chip, Body 1 x 0.5 mm; ComponentLink3Description: Package Specification; ComponentLink2Description: Datasheet; ComponentLink3URL: http://www.murata.com/products/catalog/pdf/c31e.pdf
J?#1 = CMP-2000-05404-1: 1 Port Right Angle Through Hole Mount Female Type A USB Connector, 4 Position, -55 to 85 degC, RoHS, Tube; Manufacturer: TE Connectivity; Contact Termination Type: Solder; No. of Contacts: 4; Connector Mounting: PCB; SVHC: NoSVHC(16-Jun-2014); Gender: Receptacle; Connector Type: USBA; Package Description: 4-Pin Through Hole Device, Body 14 x 13.13 mm, Pitch 2.5 mm; Contact Plating: Gold; Package Reference: 292303-1; Contact Material: Copper; Datasheet URL: http://www.farnell.com/cad/1653030.pdf; Datasheet Version: Feb-12; Manufacturer URL: http://www.te.com/
J?#2 = CMP-1531-00001-1: FastJack™ 1x1 Tab-Down Gigabit Short Body RJ45, IEEE802.3ab Compliant, -40 to 85 degC, 14-Pin 21.59 x 15.88 x 13.64 mm THD, RoHS; Manufacturer: HALO Electronics; Return Loss@60 MHz: -14 dB Min.; Speed: 10/100/1000BASE-T; PartNumber: HFJ11-E1G16E-L11RL; ComponentLink3URL: http://www.haloelectronics.com/pdf/fastjack-gigabit.pdf; Mounting Technology: Through Hole; ComponentLink1URL: www.haloelectronics.com/; RoHS: TRUE; ComponentLink2Description: Datasheet; DatasheetVersion: 04/2014; ComponentLink2URL: http://www.haloelectronics.com/pdf/fastjack-gigabit.pdf; Temperature Range: -40 to 85 degC; Latch: Tab-Down; Standard: IEEE802.3ab; ComponentLink3Description: Package Specification; PackageDescription: FastJack Gigabit Ethernet RJ45, Body 21.59 x 15.88 mm, Height 15.64 mm; ComponentLink1Description: Manufacturer URL; ComponentLink4Description: A Beginner's Guide to Ethernet 802.3; ComponentLink4URL: https://www.analog.com/media/en/technical-documentation/application-notes/EE-269.pdf
L5 L? = CMP-1373-00002-1: SMD Common Mode Noise Suppressor WE-CNSW HF,  Z= 90 Ohm; Manufacturer: Wuerth Elektronik; Impedance: 90 Ohm; PartNumber: 744233900; ComponentLink2Description: Datasheet; ComponentLink2URL: http://www.we-online.de/katalog/media/pdf/744233900.pdf; ComponentLink1Description: Manufacturer URL; PackageReference: WE-CNSW, 0805; ComponentLink1URL: http://www.we-online.com
R31 = CMP-2000-03838-1: CRCW060310K0JNEA; Manufacturer: Vishay Dale; Part Number: CRCW060310K0JNEA
R?#1-R?#4 = CMP-2000-03396-1: CRCW060349R9FKEA; Manufacturer: Vishay Dale; Part Number: CRCW060349R9FKEA
R?#5 R?#6 = CMP-2000-03239-1: CRCW0603330RFKEA; Manufacturer: Vishay Dale; Part Number: CRCW0603330RFKEA
U14 = CMP-1537-00003-1: USB 2.0 Hub and 10/100 Ethernet Controller, 3.3 V, -40 to 85 degC, 64-Pin QFN, RoHS, Tray; Manufacturer: Microchip; Interface: USB 2.0; Supply Voltage: 3.3 V; Downstreamm USB Ports: 4; DatasheetVersion: Rev. 1.2; RoHS: TRUE; ComponentLink1URL: www.microchip.com/; ComponentLink3Description: Package Specification; PartNumber: LAN9514I-JZX; ComponentLink1Description: Manufacturer URL; ComponentLink2URL: http://ww1.microchip.com/downloads/en/DeviceDoc/9514.pdf; Mounting Technology: Surface Mount; ComponentLink2Description: Datasheet; ComponentLink3URL: http://ww1.microchip.com/downloads/en/DeviceDoc/9514.pdf; Temperature Range: -40 to 85 degC; PackageDescription: 64-Pin Quad Flat Non-Leaded Package, Body 9 x 9 mm, Pitch 0.5 mm; Packing: Tray
U15 = CMP-1063-00241-1: Low Capacitance ESD Protection Array for High Speed Data Lines Protection, 10-Pin UDFN, Pb-Free, Tape and Reel; Manufacturer: On Semiconductor; V(BR) Min (V): 5; Direction: Bidirectional; VRWM Max (V): 3.3; Number of Lines: 4; PPK Max (W): 450; PackageVersion: Rev. B, 10/2012; PackageDescription: 10-Pin Small Outline No-Lead, Body 2.6 x 2.6 mm, Pitch 0.5 mm; RoHS: Pb-Free; PackageReference: UDFN-10-517AN; ComponentLink3URL: http://www.onsemi.cn/pub_link/Collateral/517AN.PDF; Packing: Tape and Reel; DatasheetVersion: Rev. 5; ComponentLink1Description: Manufacturer URL; ComponentLink1URL: http://www.onsemi.com/; ComponentLink3Description: Package Specification; ComponentLink2Description: Datasheet; IR Max (uA): 5; ComponentLink2URL: http://www.onsemi.cn/pub_link/Collateral/ESD1014-D.PDF; Mounting Technology: Surface Mount; PartNumber: ESD1014MUTAG
U? = CMP-0326-00060-2: Single Universal Serial Bus Port Transient Suppressor, 2 Channels, -40 to +85 degC, 6-pin SOT-23 (DBV), Green (RoHS & no Sb/Br); Manufacturer: Texas Instruments; IO Leakage Current(nA): 1000; Breakdown Voltage(Min)(V): 7; IO Capacitance(Typ)(pF): 35; USB Full Speed: TRUE; SubFamily: ESD Solution; ComponentLink1Description: Manufacturer URL; Eco-Plan: Green (RoHS & no Sb/Br); ComponentLink2URL: http://www.ti.com/general/docs/lit/getliterature.tsp?genericPartNumber=SN65220&fileType=pdf; PackageReference: DBV0006A; PackageDescription: 6-Pin Plastic Small-Outline Package, 2.9 x 1.6 mm Body, 0.95 mm Pitch, 2.8 mm Lead Span; PartNumber: SN65220DBVRG4; PackageVersion: revK, Mar-2006; ComponentLink1URL: http://www.ti.com/; ComponentLink2Description: Datasheet; Mounting Technology: Surface Mount; ComponentLink3URL: SamplesURL:http://www.ti.com/product/sn65220#samples; DatasheetVersion: SLLS266G; ComponentLink3Description: URL Link1

## Sheet Pi_BISS_422_485.SchDoc: =DocumentName
size B; DrawnBy: Cary Smith; Organization: Las Cumbres Observatoy; Address1: 6740 Cortona Dr.; Address2: Suite 102; Address3: Goleta, CA 93117; DocumentNumber: 1; Revision: 1; SheetNumber: 1; SheetTotal: 1000's
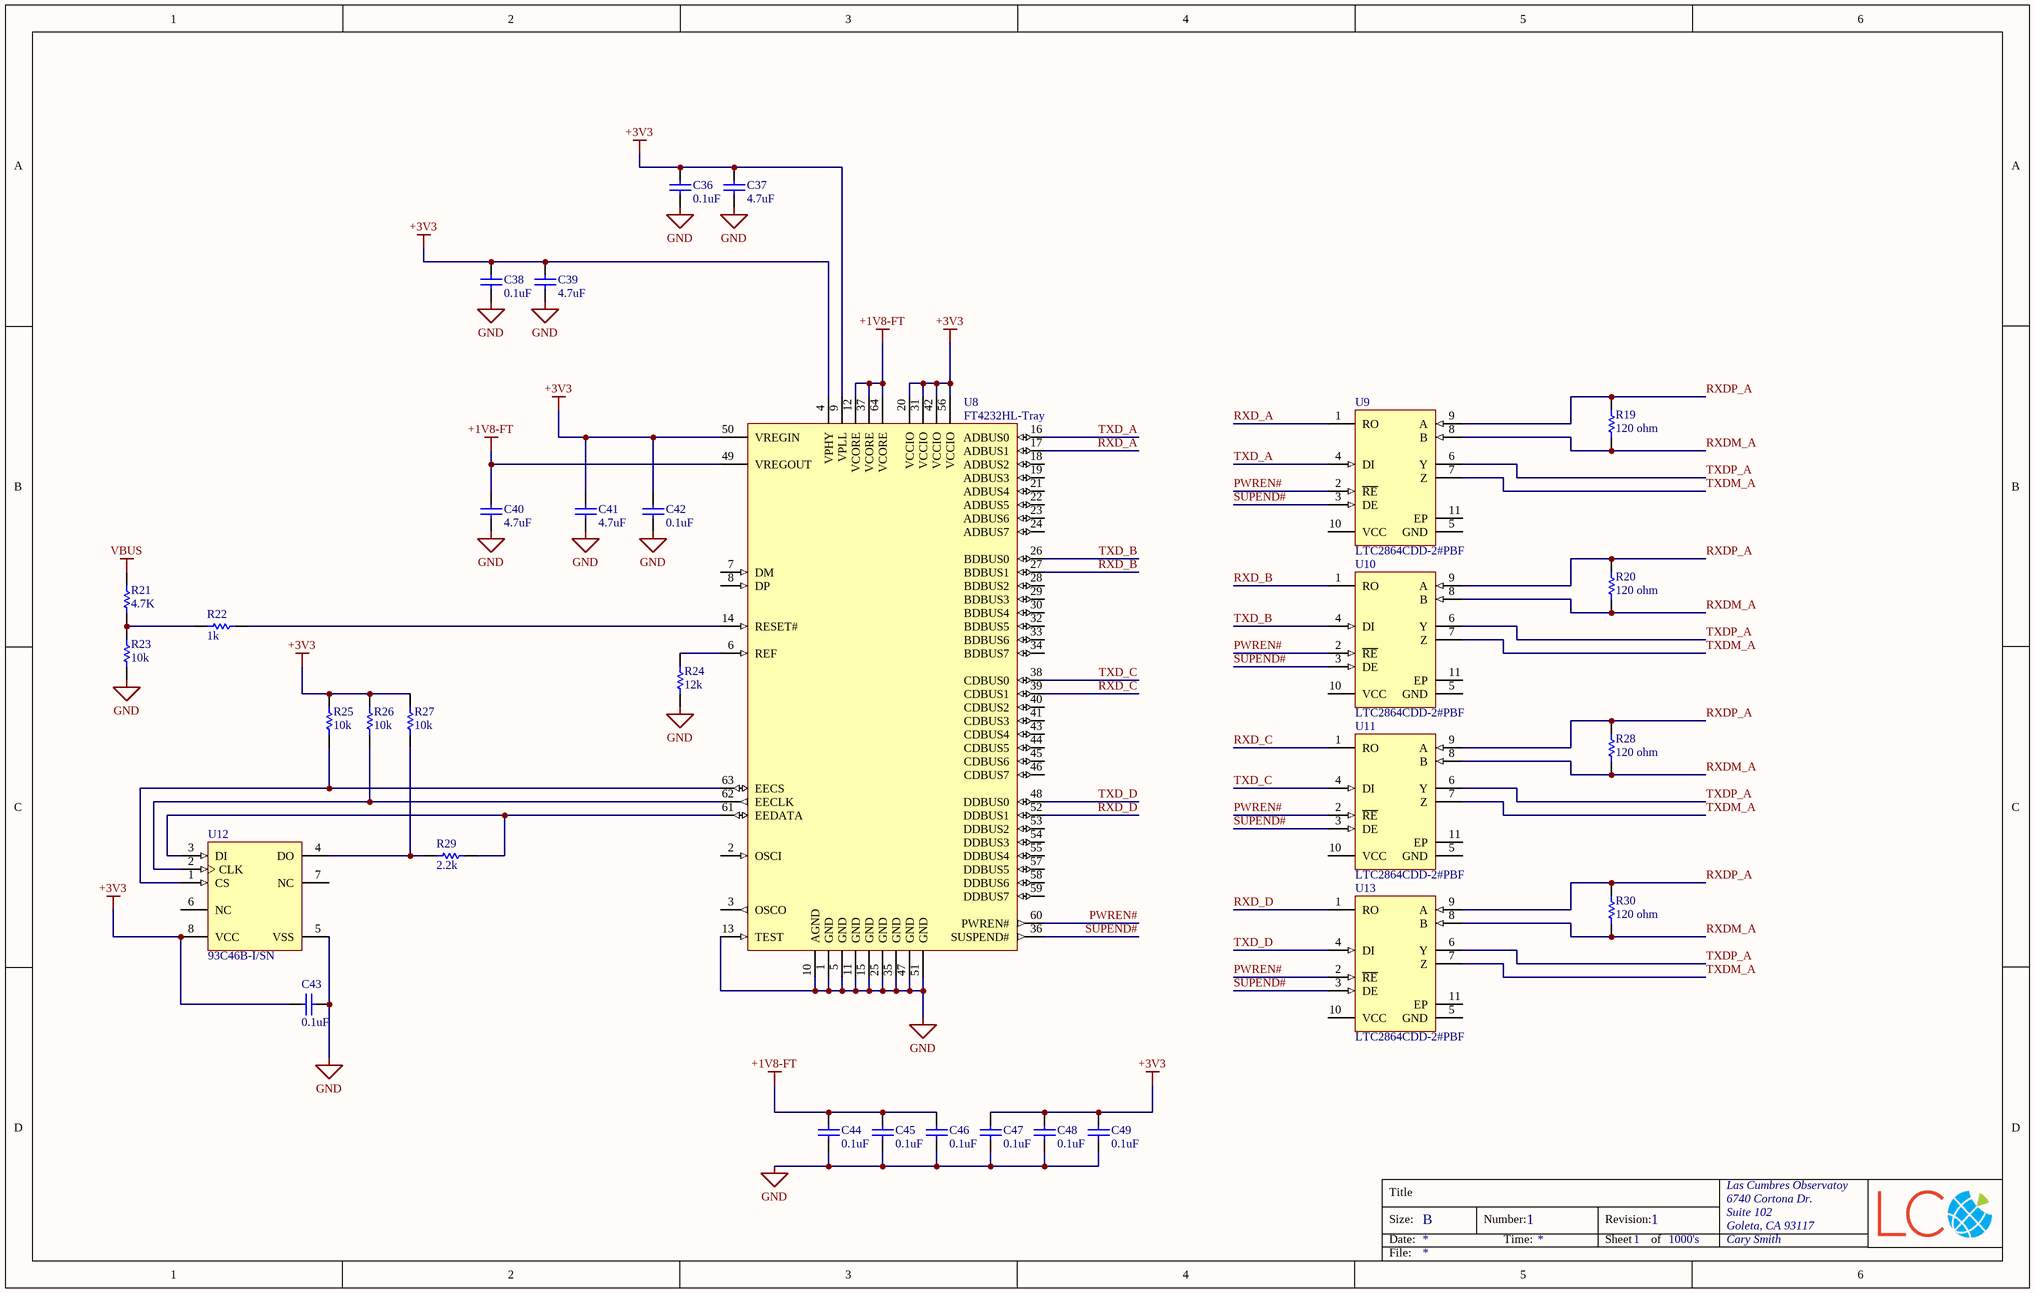
[diagram p8: Pi_BISS_422_485.SchDoc]

### Parts
C36  0.1uF  [CAPC1005X55X25ML05T10]
C37  4.7uF  [CAPC1608X90X35ML10T15]
C38  0.1uF  [CAPC1005X55X25ML05T10]
C39  4.7uF  [CAPC1608X90X35ML10T15]
C40  4.7uF  [CAPC1608X90X35ML10T15]
C41  4.7uF  [CAPC1608X90X35ML10T15]
C42  0.1uF  [CAPC1005X55X25ML05T10]
C43  0.1uF  [CAPC1005X55X25ML05T10]
C44  0.1uF  [CAPC1005X55X25ML05T10]
C45  0.1uF  [CAPC1005X55X25ML05T10]
C46  0.1uF  [CAPC1005X55X25ML05T10]
C47  0.1uF  [CAPC1005X55X25ML05T10]
C48  0.1uF  [CAPC1005X55X25ML05T10]
C49  0.1uF  [CAPC1005X55X25ML05T10]
R19  120 ohm  [RESC3216X60X45ML10T20]
R20  120 ohm  [RESC3216X60X45ML10T20]
R21  4.7K  [RESC1005X40X25ML05T05]
R22  1k  [RESC1005X40X25LL05T10]
R23  10k  [RESC1005X40X25NL05T05]
R24  12k  [RESC1005X40X25NL05T05]
R25  10k  [RESC1005X40X25NL05T05]
R26  10k  [RESC1005X40X25NL05T05]
R27  10k  [RESC1005X40X25NL05T05]
R28  120 ohm  [RESC3216X60X45ML10T20]
R29  2.2k  [RESC1005X40X25LL10T10]
R30  120 ohm  [RESC3216X60X45ML10T20]
U8  FT4232HL-Tray  [LQFP-64_M]
U9  LTC2864CDD-2#PBF  [LT-DD-10_V]
U10  LTC2864CDD-2#PBF  [LT-DD-10_V]
U11  LTC2864CDD-2#PBF  [LT-DD-10_V]
U12  93C46B-I/SN  [SOIC-SN8_M]
U13  LTC2864CDD-2#PBF  [LT-DD-10_V]

### Nets
+1V8-FT: C40.2 C44.1 C45.1 C46.1 U8.12(VCORE) U8.37(VCORE) U8.49(VREGOUT) U8.64(VCORE)
+3V3: C36.1 C37.2 C38.1 C39.2 C41.2 C42.1 C43.2 C47.1 C48.1 C49.1 R25.2 R26.2 R27.2 U8.4(VPHY) U8.9(VPLL) U8.20(VCCIO) U8.31(VCCIO) U8.42(VCCIO) U8.50(VREGIN) U8.56(VCCIO) U12.8(VCC)
GND: C36.2 C37.1 C38.2 C39.1 C40.1 C41.1 C42.2 C43.1 C44.2 C45.2 C46.2 C47.2 C48.2 C49.2 R23.1 R24.1 U8.1(GND) U8.5(GND) U8.10(AGND) U8.11(GND) U8.13(TEST) U8.15(GND) U8.25(GND) U8.35(GND) U8.47(GND) U8.51(GND) U12.5(VSS)
VBUS: R21.2
PWREN#: U8.60(PWREN#) U9.2(~{RE}) U10.2(~{RE}) U11.2(~{RE}) U13.2(~{RE})
RXD_A: U8.17(ADBUS1) U9.1(RO)
RXD_B: U8.27(BDBUS1) U10.1(RO)
RXD_C: U8.39(CDBUS1) U11.1(RO)
RXD_D: U8.52(DDBUS1) U13.1(RO)
RXDM_A: R19.1 R20.1 R28.1 R30.1 U9.8(B) U10.8(B) U11.8(B) U13.8(B)
RXDP_A: R19.2 R20.2 R28.2 R30.2 U9.9(A) U10.9(A) U11.9(A) U13.9(A)
SUPEND#: U8.36(SUSPEND#) U9.3(DE) U10.3(DE) U11.3(DE) U13.3(DE)
TXD_A: U8.16(ADBUS0) U9.4(DI)
TXD_B: U8.26(BDBUS0) U10.4(DI)
TXD_C: U8.38(CDBUS0) U11.4(DI)
TXD_D: U8.48(DDBUS0) U13.4(DI)
TXDM_A: U9.7(Z) U10.7(Z) U11.7(Z) U13.7(Z)
TXDP_A: U9.6(Y) U10.6(Y) U11.6(Y) U13.6(Y)
NetR21_1: R21.1 R22.1 R23.2
NetR22_2: R22.2 U8.14(RESET#)
NetR24_2: R24.2 U8.6(REF)
NetR25_1: R25.1 U8.63(EECS) U12.1(CS)
NetR26_1: R26.1 U8.62(EECLK) U12.2(CLK)
NetR27_1: R27.1 R29.1 U12.4(DO)
NetR29_2: R29.2 U8.61(EEDATA) U12.3(DI)

Not connected (* = marked no-connect by the designer): U8 2(OSCI) 3(OSCO) 7(DM) 8(DP) 18(ADBUS2) 19(ADBUS3) 21(ADBUS4) 22(ADBUS5) 23(ADBUS6) 24(ADBUS7) 28(BDBUS2) 29(BDBUS3) 30(BDBUS4) 32(BDBUS5) 33(BDBUS6) 34(BDBUS7) 40(CDBUS2) 41(CDBUS3) 43(CDBUS4) 44(CDBUS5) 45(CDBUS6) 46(CDBUS7) 53(DDBUS2) 54(DDBUS3) 55(DDBUS4) 57(DDBUS5) 58(DDBUS6) 59(DDBUS7); U9 5(GND) 10(VCC) 11(EP); U10 5(GND) 10(VCC) 11(EP); U11 5(GND) 10(VCC) 11(EP); U12 6(NC) 7(NC); U13 5(GND) 10(VCC) 11(EP)

### Notes on the sheet
- Title
- Size:
- Date:
- B
- Number:
- Time:
- Revision:
- Sheet
- of
- File:

### Library data of the parts
C36 C38 C42-C49 = CMP-2008-02013-1: as C14 on sheet Pi_Power; Part Number: VJ0402G104KXQCW1BC
C37 C39-C41 = CMP-2006-02799-2: Chip Capacitor, 4.7 uF, +/- 10%, 6.3 V, -55 to 85 degC, 0603 (1608 Metric), RoHS, Tape and Reel GRM188R60J475KE19D; Voltage Rating (DC): 3 V; Voltage Rating: 6.3 V; Type (Capacitors): X5R; Case/Package: 0603; Case Code (Imperial): 0603; Packaging: Tape and Reel; Mount: Surface Mount; Height: 0.8 mm; REACH SVHC: No SVHC; ComponentLink1URL: http://www.murata.com/; ComponentLink2URL: http://psearch.en.murata.com/capacitor/product/GRM188R60J475KE19%23.pdf; Min Operating Temperature: -55 degC; Max Operating Temperature: 85 degC; Length: 1.6 mm; Case Code (Metric): 1608; Radiation Hardening: No; PackageDescription: 2-Pin Surface Mount Device, Body 1.6 x 0.8 mm; RoHSCompliant: true; PartNumber: GRM188R60J475KE19D; Tolerance: 10%; Width: 0.8 mm; ComponentLink1Description: Manufacturer URL; Mounting Technology: Surface Mount; ComponentLink2Description: Datasheet; Capacitance: 4.7 uF; Package Quantity: 4000; DatasheetVersion: 08/2016
R19 R20 R28 R30 = CMP-2003-04839-1: CRCW1206120RJNEA; Manufacturer: Vishay Dale; Part Number: CRCW1206120RJNEA
R21 = CMP-2002-00051-2: Chip Resistor, 4.7 KOhm, +/- 1%, 63 mW, -55 to 155 degC, 0402 (1005 Metric), RoHS, Tape and Reel CRCW04024K70FKED; Power Rating: 63 mW; Voltage Rating: 50 V; Length: 1 mm; Mount: Surface Mount; Case Code (Metric): 1005; ComponentLink1Description: Datasheet; Package Quantity: 10000; Case Code (Imperial): 0402; Max Operating Temperature: 155 degC; PartNumber: CRCW04024K70FKED; Case/Package: 0402; REACH SVHC: Unknown; PackageDescription: 2-Pin Surface Mount Device, Body 1 x 0.5 mm; Width: 0.5 mm; Min Operating Temperature: -55 degC; Resistance: 4.7 KOhm; Height: 0.35 mm; Packaging: Tape and Reel; Mounting Technology: Surface Mount; Tolerance: 1%; RoHSCompliant: True; ComponentLink1URL: http://www.vishay.com/docs/20035/dcrcwe3.pdf
R22 = CMP-2002-03045-1: CRCW04021K00FKEDHP; Manufacturer: Vishay Dale; Part Number: CRCW04021K00FKEDHP
R23 R25-R27 = CMP-2002-08135-1: as R6 on sheet Pi_Power; Part Number: CRCW040210K0FKED
R24 = CMP-2002-08177-1: CRCW040212K0FKED; Manufacturer: Vishay Dale; Part Number: CRCW040212K0FKED
R29 = CMP-2002-03743-1: RK73B1ETTP222J; Manufacturer: KOA Speer; Part Number: RK73B1ETTP222J
U8 = CMP-0078-00018-3: Quad High Speed USB To Multipurpose UART/MPSSE IC, 64-pin LQFP, Tray; Manufacturer: FTDI; PartNumber: FT4232HL-Tray; RevisionNote: DatasheetVersion updated to 2.2 Jan-2012; PackageReference: LQFP-64; ComponentLink1URL: http://www.ftdichip.com/; ComponentLink2URL: http://www.ftdichip.com/Support/Documents/DataSheets/ICs/DS_FT4232H.pdf; PackageVersion: Jan-12; ComponentLink2Description: Datasheet; DatasheetVersion: ver 2.2, Jan-2012; PackageDescription: 64-Pin Thin Quad Flat Pack, 10 x 10 x 1.4 mm Body, 0.5 mm Pitch; ComponentLink1Description: Manufacturer URL
U9-U11 U13 = CMP-1336-00005-1: RS485/RS422 Transceiver, Fault Protected +/- 60 V, 3 to 5.5 V, 0 to 70 degC, 10-Pin DFN (DD-10), RoHS, Tube; Manufacturer: Linear Technology; Fault Protected: +/- 60 V; Duplex: Full; Receiver Hysteresis: 25 mV; Drivers: 1; fMAX: 250 kbps Min.; Packing: Tube; PackageDescription: 10-Pin Plastic Dual Flat Package, Body 3 x 3 mm, Pitch 0.5 mm; DatasheetVersion: Rev. C; RoHS: TRUE; PackageVersion: Rev. C; ComponentLink2URL: http://cds.linear.com/docs/en/datasheet/2862345fc.pdf; VCC: 3 to 5.5 V; Temperature Range: 0 to 70 degC; PartNumber: LTC2864CDD-2#PBF; ComponentLink3Description: Package Specification; Mounting Technology: Surface Mount; ComponentLink2Description: Datasheet; ComponentLink3URL: http://cds.linear.com/docs/en/packaging/DFN_10_05-08-1699.pdf; ComponentLink1Description: Manufacturer URL; ComponentLink1URL: http://www.linear.com/
U12 = CMP-0162-00274-1: 1K, 64x16-bit, 5.0V Microwire Serial EEPROM, 8-Pin SOIC 150mil, Industrial Temperature; Code_IPC: SOIC127P600-8; PackageDescription: 8-Lead Plastic Small Outline (SN) - Narrow, 3.90mm Body [SOIC]; PackageVersion: revBB, Aug-2009; DatasheetVersion: revG, May-2008; PackageReference: SOIC-SN8; Code_JEDEC: MS-012

## Nets that join several sheets
+3.3V: Pi_Power (C2.2 L2.2 R2.2 U1.5), Pi_FPGA (27 pins), Pi_USB_2_UART (C33.2 U6.3 U6.13 U6.14)
+3V3: Pi_SD_CARD (7 pins), Pi_Ethernet_USB (14 pins), Pi_BISS_422_485 (21 pins)
GND: Pi_Power (9 pins), Pi_FPGA (22 pins), Pi_USB_2_UART (14 pins), Pi_HDMI (8 pins), Pi_SD_CARD (5 pins), Pi_Ethernet_USB (20 pins), Pi_BISS_422_485 (27 pins)